# EAGLE design FilterSchematicsAttempt3 (EAGLE 8.2.2)
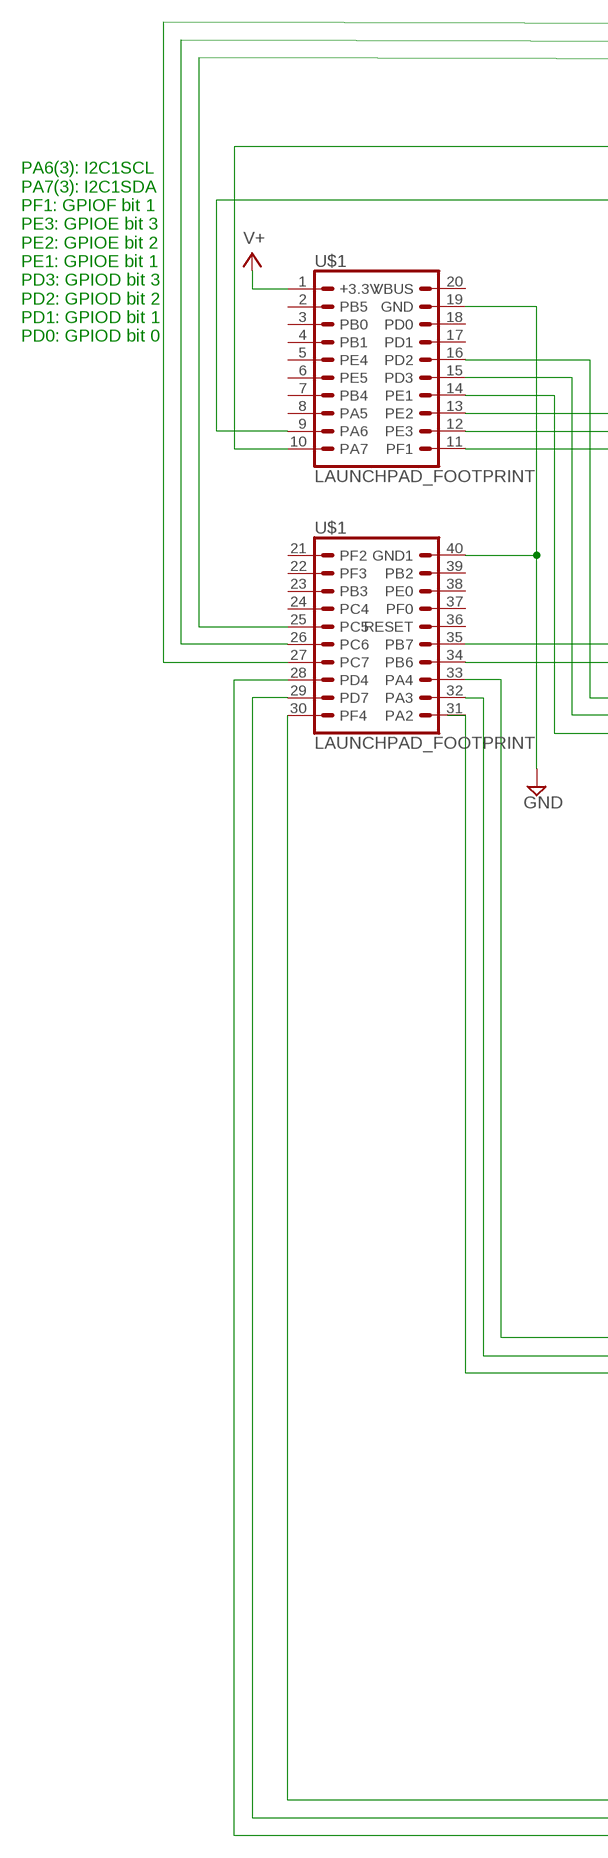
[diagram p0: schematic, sheet 1, part 1 of 3]
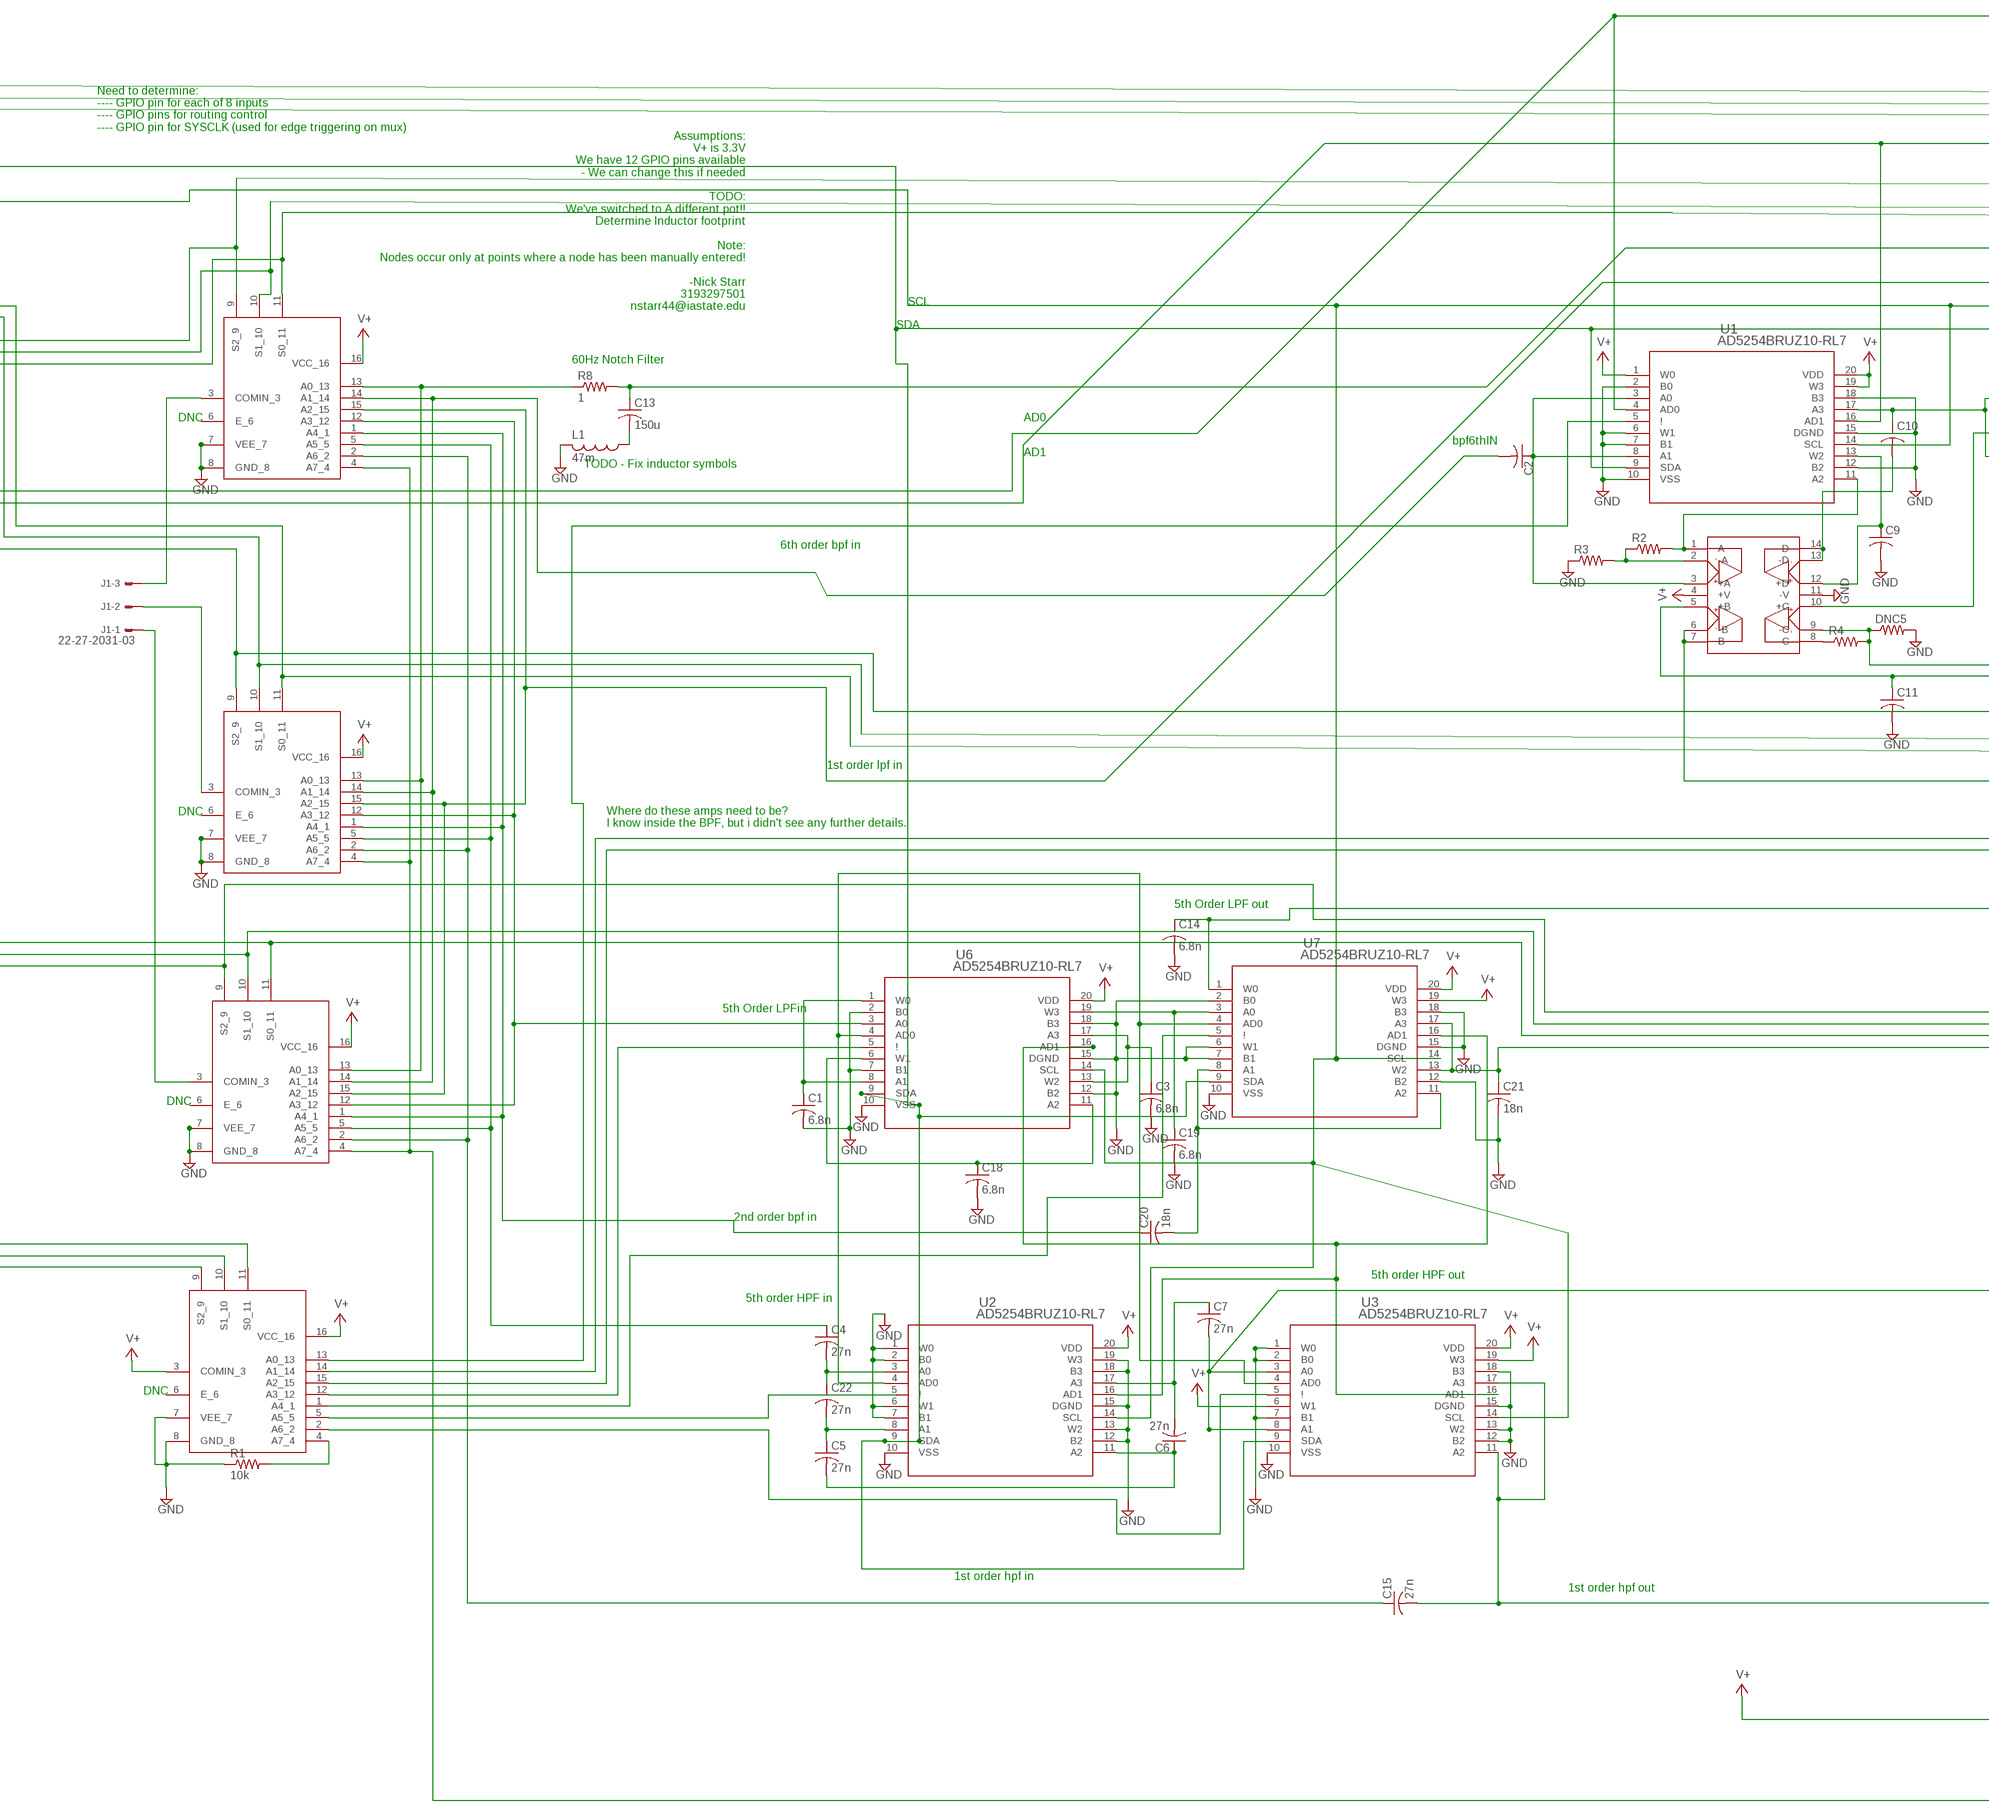
[diagram p1: schematic, sheet 1, part 2 of 3]
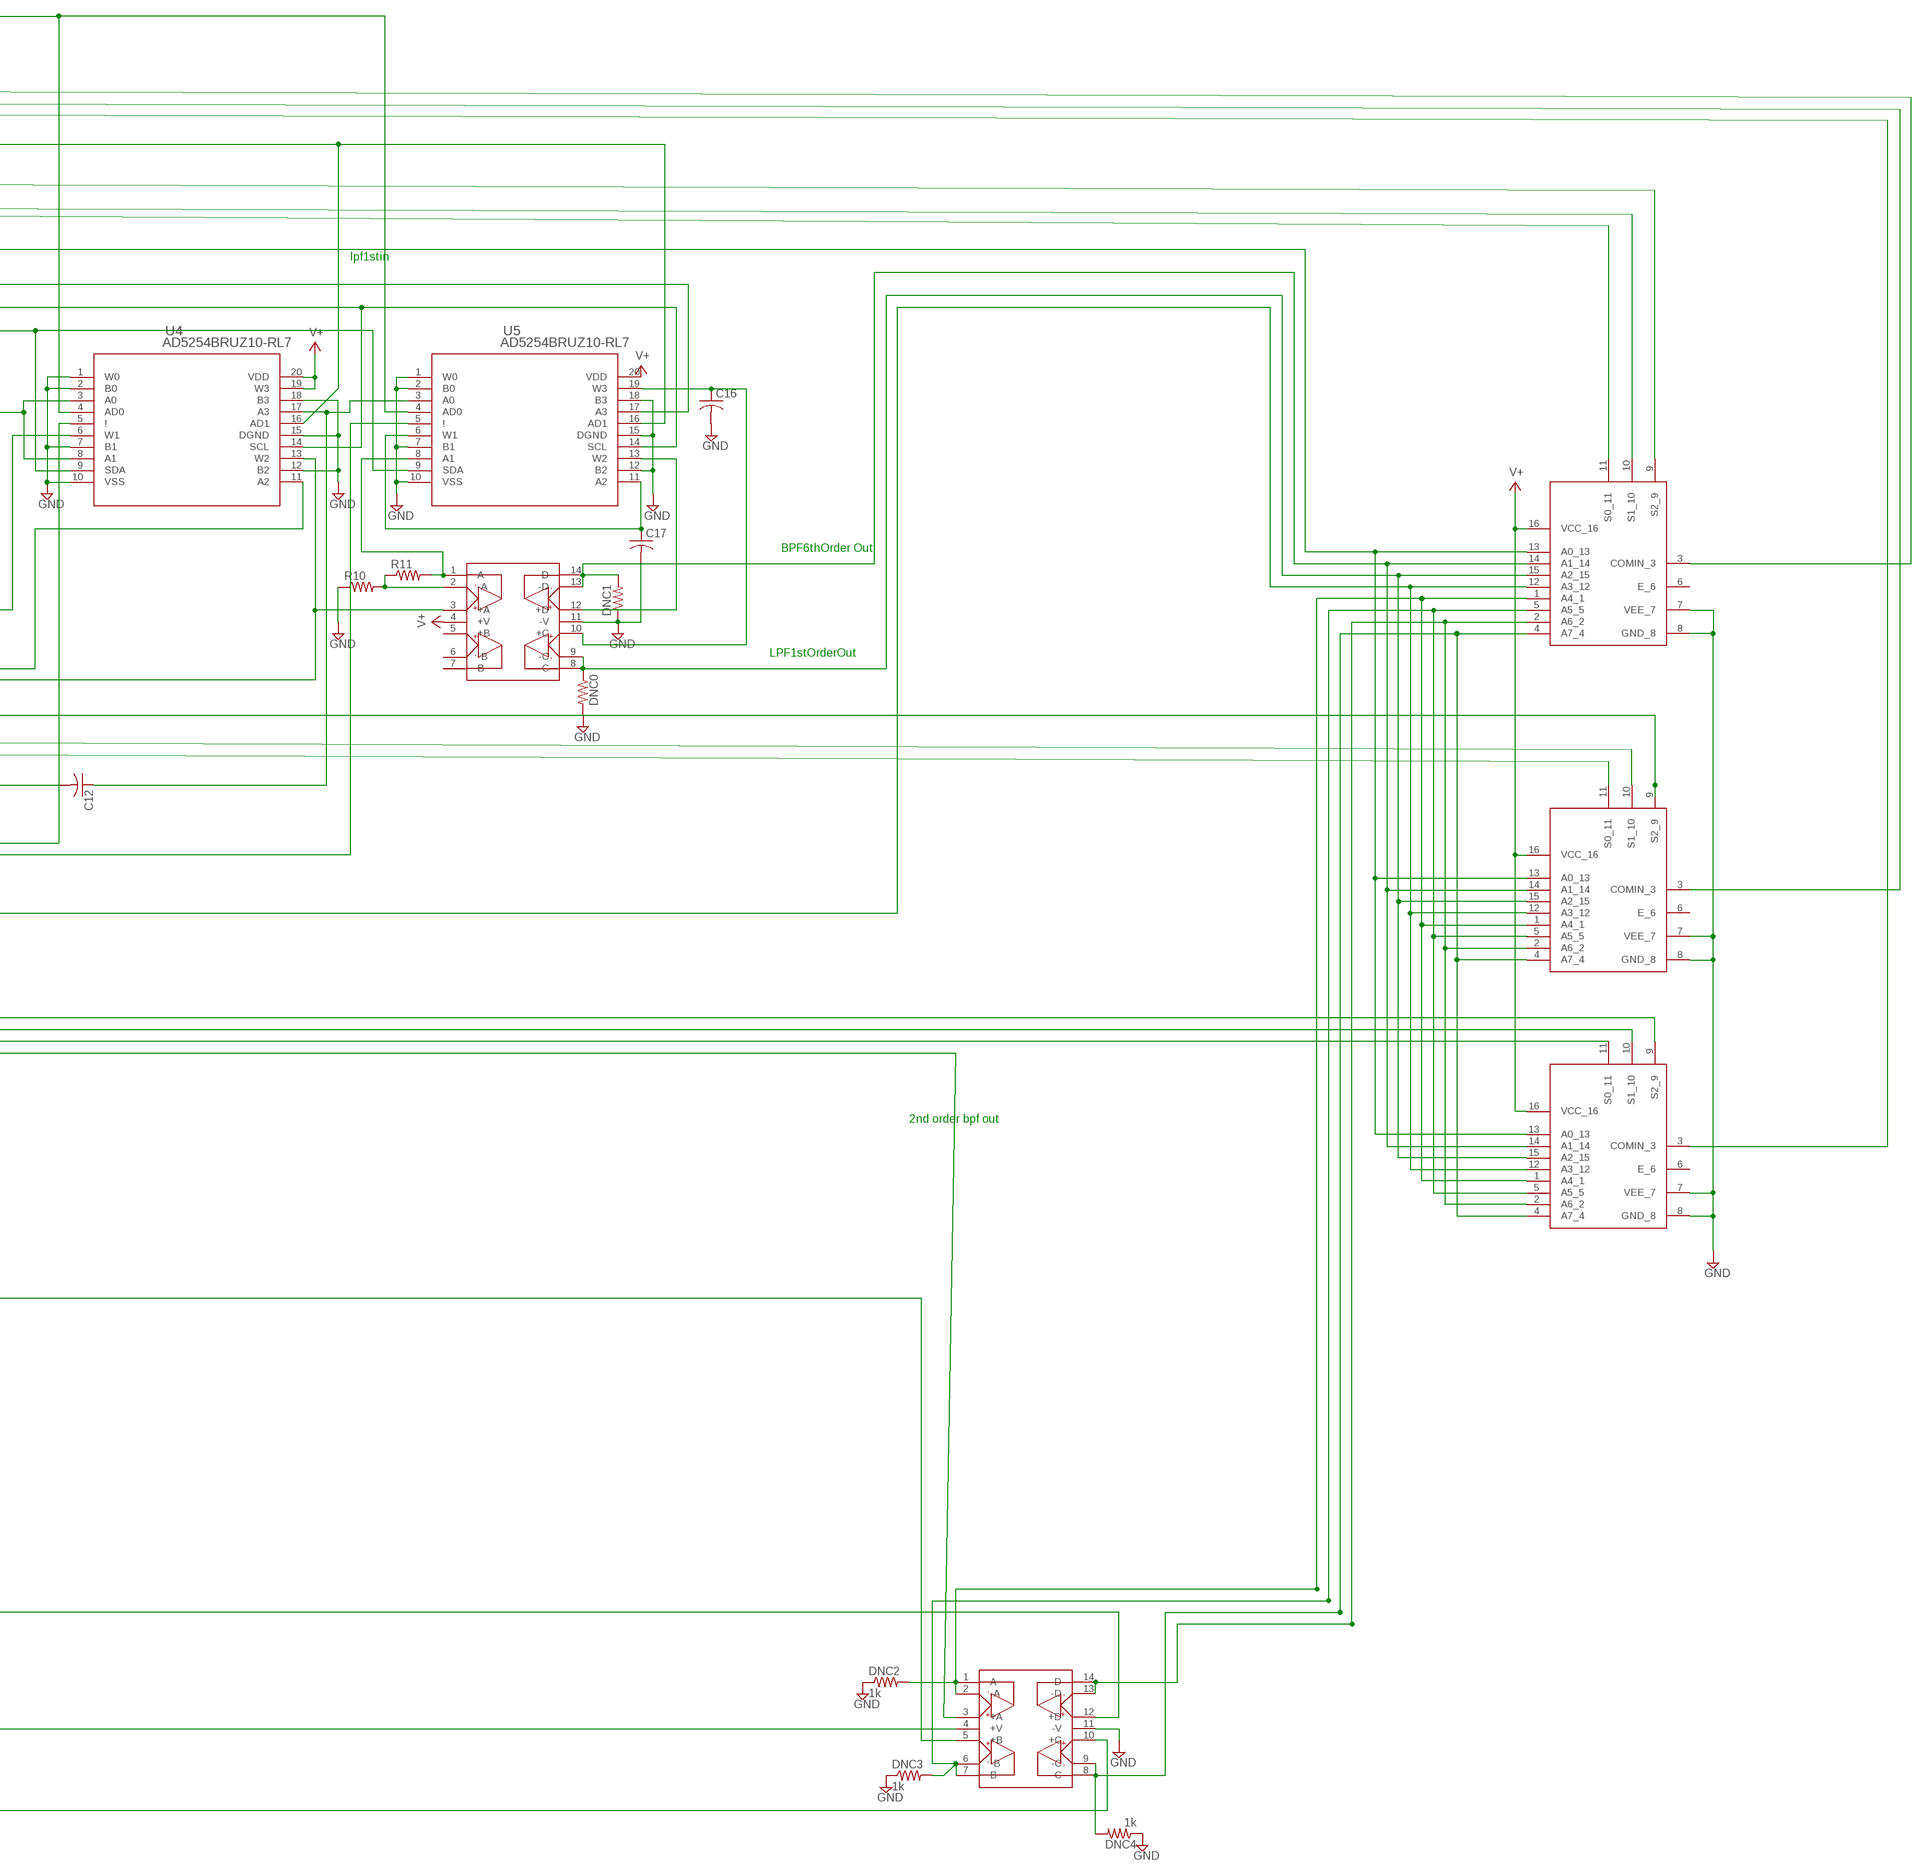
[diagram p2: schematic, sheet 1, part 3 of 3]

## Parts
C1  6.8n  C-USC0805  [C0805]
C2  C-USC0805  [C0805]
C3  6.8n  C-USC0805  [C0805]
C4  27n  C-USC0805  [C0805]
C5  27n  C-USC0805  [C0805]
C6  27n  C-USC0805  [C0805]
C7  27n  C-USC0805  [C0805]
C9  C-USC0805  [C0805]
C10  C-USC0805  [C0805]
C11  C-USC0805  [C0805]
C12  C-USC0805  [C0805]
C13  150u  C-USC0805  [C0805]
C14  6.8n  C-USC0805  [C0805]
C15  27n  C-USC0805  [C0805]
C16  C-USC0805  [C0805]
C17  C-USC0805  [C0805]
C18  6.8n  C-USC0805  [C0805]
C19  6.8n  C-USC0805  [C0805]
C20  18n  C-USC0805  [C0805]
C21  18n  C-USC0805  [C0805]
C22  27n  C-USC0805  [C0805]
DNC0  R-US_R0805  [R0805]
DNC1  R-US_R0805  [R0805]
DNC2  1k  R-US_R0805  [R0805]
DNC3  1k  R-US_R0805  [R0805]
DNC4  1k  R-US_R0805  [R0805]
DNC5  R-US_R0805  [R0805]
J1  22-27-2031-03  [6410-03]
L1  47m  L-US0204/5  [0204/5]
R1  10k  R-US_R0805  [R0805]
R2  R-US_R0805  [R0805]
R3  R-US_R0805  [R0805]
R4  R-US_R0805  [R0805]
R8  1  R-US_R0805  [R0805]
R10  R-US_R0805  [R0805]
R11  R-US_R0805  [R0805]
U1  AD5254BRUZ10-RL7  [RU_20]
U2  AD5254BRUZ10-RL7  [RU_20]
U3  AD5254BRUZ10-RL7  [RU_20]
U4  AD5254BRUZ10-RL7  [RU_20]
U5  AD5254BRUZ10-RL7  [RU_20]
U6  AD5254BRUZ10-RL7  [RU_20]
U7  AD5254BRUZ10-RL7  [RU_20]
U$1  LAUNCHPAD_FOOTPRINT  [SSW-110-02-S-D]
U$2  OPA4830  [TSSOP14]
U$3  CD74HC4051-Q1  [TSSOP16]
U$4  CD74HC4051-Q1  [TSSOP16]
U$5  CD74HC4051-Q1  [TSSOP16]
U$6  CD74HC4051-Q1  [TSSOP16]
U$7  OPA4830  [TSSOP14]
U$21  CD74HC4051-Q1  [TSSOP16]
U$22  CD74HC4051-Q1  [TSSOP16]
U$23  CD74HC4051-Q1  [TSSOP16]
U$25  OPA4830  [TSSOP14]

## Nets
GND: C1.2 C3.2 C9.2 C11.2 C14.2 C16.2 C17.2 C18.2 C19.2 C21.2 DNC0.2 DNC1.1 DNC2.1 DNC3.1 DNC4.1 DNC5.2 L1.2 R1.1 R3.1 R10.1 U1.2(B0) U1.6(W1) U1.7(B1) U1.10(VSS) U1.12(B2) U1.15(DGND) U1.18(B3) U2.1(W0) U2.2(B0) U2.6(W1) U2.7(B1) U2.10(VSS) U2.12(B2) U2.13(W2) U2.15(DGND) U2.18(B3) U2.19(W3) U3.1(W0) U3.2(B0) U3.7(B1) U3.10(VSS) U3.12(B2) U3.13(W2) U3.15(DGND) U3.18(B3) U4.1(W0) U4.2(B0) U4.7(B1) U4.10(VSS) U4.12(B2) U4.15(DGND) U4.18(B3) U5.1(W0) U5.2(B0) U5.7(B1) U5.10(VSS) U5.12(B2) U5.15(DGND) U5.18(B3) U6.2(B0) U6.7(B1) U6.10(VSS) U6.12(B2) U6.15(DGND) U6.18(B3) U7.2(B0) U7.6(W1) U7.7(B1) U7.10(VSS) U7.12(B2) U7.15(DGND) U7.18(B3) U$1.19(GND) U$1.40(GND1) U$2.11(-V) U$3.7(VEE_7) U$3.8(GND_8) U$4.7(VEE_7) U$4.8(GND_8) U$5.7(VEE_7) U$5.8(GND_8) U$6.7(VEE_7) U$6.8(GND_8) U$7.11(-V) U$21.7(VEE_7) U$21.8(GND_8) U$22.8(GND_8) U$23.7(VEE_7) U$23.8(GND_8)
N$1: J1.3 U$21.3(COMIN_3)
N$2: J1.2 U$22.3(COMIN_3)
N$3: J1.1 U$23.3(COMIN_3)
N$4: U$1.11(PF1) U$3.11(S0_11) U$21.11(S0_11)
N$5: C5.1 C22.2 U2.8(A1)
N$6: C4.2 C22.1 U2.3(A0)
N$7: C5.2 C6.1 U2.11(A2)
N$8: U$1.12(PE3) U$3.10(S1_10) U$21.10(S1_10)
N$9: U$1.13(PE2) U$3.9(S2_9) U$21.9(S2_9)
N$10: U$1.16(PD2) U$4.11(S0_11) U$22.11(S0_11)
N$11: U$1.15(PD3) U$4.10(S1_10) U$22.10(S1_10)
N$12: C2.1 U1.3(A0) U1.8(A1) U$2.3(+A)
N$13: C10.1 U1.17(A3) U4.3(A0) U4.8(A1)
N$14: C13.2 L1.1
N$15: U5.17(A3) U$21.15(A2_15) U$22.15(A2_15) U$23.15(A2_15)
N$16: C15.1 U$21.2(A6_2) U$22.2(A6_2) U$23.2(A6_2)
N$17: C15.2 U3.11(A2) U3.17(A3) U$25.12(+D)
N$18: U6.3(A0) U$21.12(A3_12) U$22.12(A3_12) U$23.12(A3_12)
N$19: U1.5(!) U$6.13(A0_13)
N$20: C1.1 U6.1(W0) U6.8(A1)
N$21: C3.1 U6.13(W2) U6.17(A3)
N$22: C18.1 U6.6(W1) U6.11(A2)
N$23: U$1.33(PA4) U$5.11(S0_11) U$23.11(S0_11)
N$24: R8.1 U$21.13(A0_13) U$22.13(A0_13) U$23.13(A0_13)
N$25: C2.2 U$21.14(A1_14) U$22.14(A1_14) U$23.14(A1_14)
N$26: U$1.32(PA3) U$5.10(S1_10) U$23.10(S1_10)
N$27: U$5.9(S2_9) U$23.9(S2_9)
N$28: R2.2 U1.11(A2) U$2.1(A)
N$29: C4.1 U$21.5(A5_5) U$22.5(A5_5) U$23.5(A5_5)
N$30: C21.1 U7.13(W2) U7.17(A3) U$25.3(+A)
N$31: U$21.4(A7_4) U$22.4(A7_4) U$23.4(A7_4) U$25.10(+C)
N$32: U1.9(SDA) U2.9(SDA) U3.9(SDA) U4.9(SDA) U5.9(SDA) U6.9(SDA) U7.9(SDA) U$1.10(PA7)
N$33: R1.2 U$6.4(A7_4)
N$34: U4.5(!) U$6.14(A1_14)
N$35: U5.5(!) U$6.15(A2_15)
N$36: U6.5(!) U$6.12(A3_12)
N$37: U7.5(!) U$6.1(A4_1)
N$38: U$6.5(A5_5)
N$41: C19.1 U6.19(W3) U7.3(A0)
N$42: DNC0.1 U$3.15(A2_15) U$4.15(A2_15) U$5.15(A2_15) U$7.8(C) U$7.9(-C)
N$44: U3.5(!) U$6.2(A6_2)
N$45: R2.1 R3.2 U$2.2(-A)
N$46: DNC3.2 U$3.5(A5_5) U$4.5(A5_5) U$5.5(A5_5) U$25.6(-B) U$25.7(B)
N$47: DNC2.2 U$3.1(A4_1) U$4.1(A4_1) U$5.1(A4_1) U$25.1(A) U$25.2(-A)
N$48: U$3.2(A6_2) U$4.2(A6_2) U$5.2(A6_2) U$25.13(-D) U$25.14(D)
N$49: DNC4.2 U$3.4(A7_4) U$4.4(A7_4) U$5.4(A7_4) U$25.8(C) U$25.9(-C)
N$50: C9.1 U1.13(W2) U$2.12(+D)
N$52: U1.16(AD1) U4.16(AD1) U5.16(AD1) U$1.34(PB6)
N$53: U4.6(W1) U$2.10(+C)
N$54: C10.2 U$2.13(-D) U$2.14(D)
N$55: U2.16(AD1) U3.16(AD1) U6.16(AD1) U7.16(AD1)
N$56: U$1.30(PF4) U$6.11(S0_11)
N$57: R4.1 U$2.8(C)
N$58: DNC5.1 R4.2 U4.11(A2) U$2.9(-C)
N$59: C20.1 U$21.1(A4_1) U$22.1(A4_1) U$23.1(A4_1)
N$60: C20.2 U7.8(A1) U7.11(A2)
N$61: U$22.7(VEE_7)
N$62: C6.2 C7.1 U2.17(A3)
N$63: C11.1 U4.13(W2) U$2.5(+B) U$7.3(+A)
N$64: U$1.25(PC5) U$5.3(COMIN_3)
N$65: U$1.26(PC6) U$4.3(COMIN_3)
N$66: U$1.28(PD4) U$6.9(S2_9)
N$67: C7.2 U3.3(A0) U3.8(A1) U$25.5(+B)
N$68: U$1.29(PD7) U$6.10(S1_10)
N$69: U$1.27(PC7) U$3.3(COMIN_3)
N$70: C12.1 U4.17(A3) U5.3(A0)
N$72: C12.2 U$2.6(-B) U$2.7(B)
N$73: R11.2 U5.8(A1) U$7.1(A)
N$74: R10.2 R11.1 U$7.2(-A)
N$75: C17.1 U5.6(W1) U5.11(A2)
N$76: U5.13(W2) U$7.12(+D)
N$77: DNC1.2 U$3.14(A1_14) U$4.14(A1_14) U$5.14(A1_14) U$7.13(-D) U$7.14(D)
N$79: C16.1 U5.19(W3) U$7.10(+C)
N$80: C14.1 U7.1(W0) U$3.12(A3_12) U$4.12(A3_12) U$5.12(A3_12)
N$88: C13.1 R8.2 U$3.13(A0_13) U$4.13(A0_13) U$5.13(A0_13)
N$95: U$1.14(PE1) U$4.9(S2_9) U$22.9(S2_9)
N$97: U2.4(AD0) U3.4(AD0) U6.4(AD0) U7.4(AD0)
N$98: U1.4(AD0) U4.4(AD0) U5.4(AD0) U$1.35(PB7)
N$101: U1.14(SCL) U2.14(SCL) U3.14(SCL) U4.14(SCL) U5.14(SCL) U6.14(SCL) U7.14(SCL) U$1.9(PA6)
V+: U1.1(W0) U1.19(W3) U1.20(VDD) U2.20(VDD) U3.6(W1) U3.19(W3) U3.20(VDD) U4.19(W3) U4.20(VDD) U5.20(VDD) U6.20(VDD) U7.19(W3) U7.20(VDD) U$1.1(+3.3V) U$2.4(+V) U$3.16(VCC_16) U$4.16(VCC_16) U$5.16(VCC_16) U$6.3(COMIN_3) U$6.16(VCC_16) U$7.4(+V) U$22.16(VCC_16) U$23.16(VCC_16) U$25.4(+V)
V-: U$25.11(-V) ; supply symbol labelled GND
Unconnected: U2.5(!) U$1.2(PB5) U$1.3(PB0) U$1.4(PB1) U$1.5(PE4) U$1.6(PE5) U$1.7(PB4) U$1.8(PA5) U$1.17(PD1) U$1.18(PD0) U$1.20(VBUS) U$1.21(PF2) U$1.22(PF3) U$1.23(PB3) U$1.24(PC4) U$1.31(PA2) U$1.36(RESET) U$1.37(PF0) U$1.38(PE0) U$1.39(PB2) U$3.6(E_6) U$4.6(E_6) U$5.6(E_6) U$6.6(E_6) U$7.5(+B) U$7.6(-B) U$7.7(B) U$21.6(E_6) U$21.16(VCC_16) U$22.6(E_6) U$23.6(E_6)

## Notes on the sheet
- Assumptions:
  V+ is 3.3V
  We have 12 GPIO pins available
  - We can change this if needed
  
  TODO:
  We've switched to A different pot!!
  Determine Inductor footprint
  
  Note:
  Nodes occur only at points where a node has been manually entered!
  
  -Nick Starr
  3193297501
  nstarr44@iastate.edu
- Need to determine:
  ---- GPIO pin for each of 8 inputs
  ---- GPIO pins for routing control
  ---- GPIO pin for SYSCLK (used for edge triggering on mux)
- lpf1stin
- PA6(3): I2C1SCL
  PA7(3): I2C1SDA
  PF1: GPIOF bit 1
  PE3: GPIOE bit 3
  PE2: GPIOE bit 2
  PE1: GPIOE bit 1
  PD3: GPIOD bit 3
  PD2: GPIOD bit 2
  PD1: GPIOD bit 1
  PD0: GPIOD bit 0
- SCL
- SDA
- 60Hz Notch Filter
- DNC | AD0
- bpf6thIN
- AD1
- TODO - Fix inductor symbols
- 6th order bpf in | BPF6thOrder Out
- LPF1stOrderOut
- 1st order lpf in
- DNC
- Where do these amps need to be?
  I know inside the BPF, but i didn't see any further details.
- 5th Order LPF out
- 5th Order LPFin
- DNC
- 2nd order bpf out
- 2nd order bpf in
- 5th order HPF out
- 5th order HPF in
- DNC
- 1st order hpf in
- 1st order hpf out

## Library data of the parts
C1-C7 C9-C22 = rcl:C-US: CAPACITOR, American symbol
DNC0 DNC1-DNC5 R1-R4 R8 R10 R11 = rcl:R-US_: RESISTOR, American symbol
J1 = con-molex:22-?-03: CONNECTOR wire to board 2.54 mm (.1 inch) pitch header; OC_FARNELL: unknown; OC_NEWARK: unknown
L1 = rcl:L-US: INDUCTOR, American symbol
U1-U7 = 491Library:AD5254BRUZ10-RL7; MANUFACTURER_PART_NUMBER: AD5254BRUZ10RL7; VENDOR: Analog Devices Inc
U$1 = 491Library:LAUNCHPAD_FOOTPRINT
U$2 U$7 U$25 = 491Library:OPA4830
U$3-U$6 U$21-U$23 = 491Library:CD74HC4051-Q1

## Board
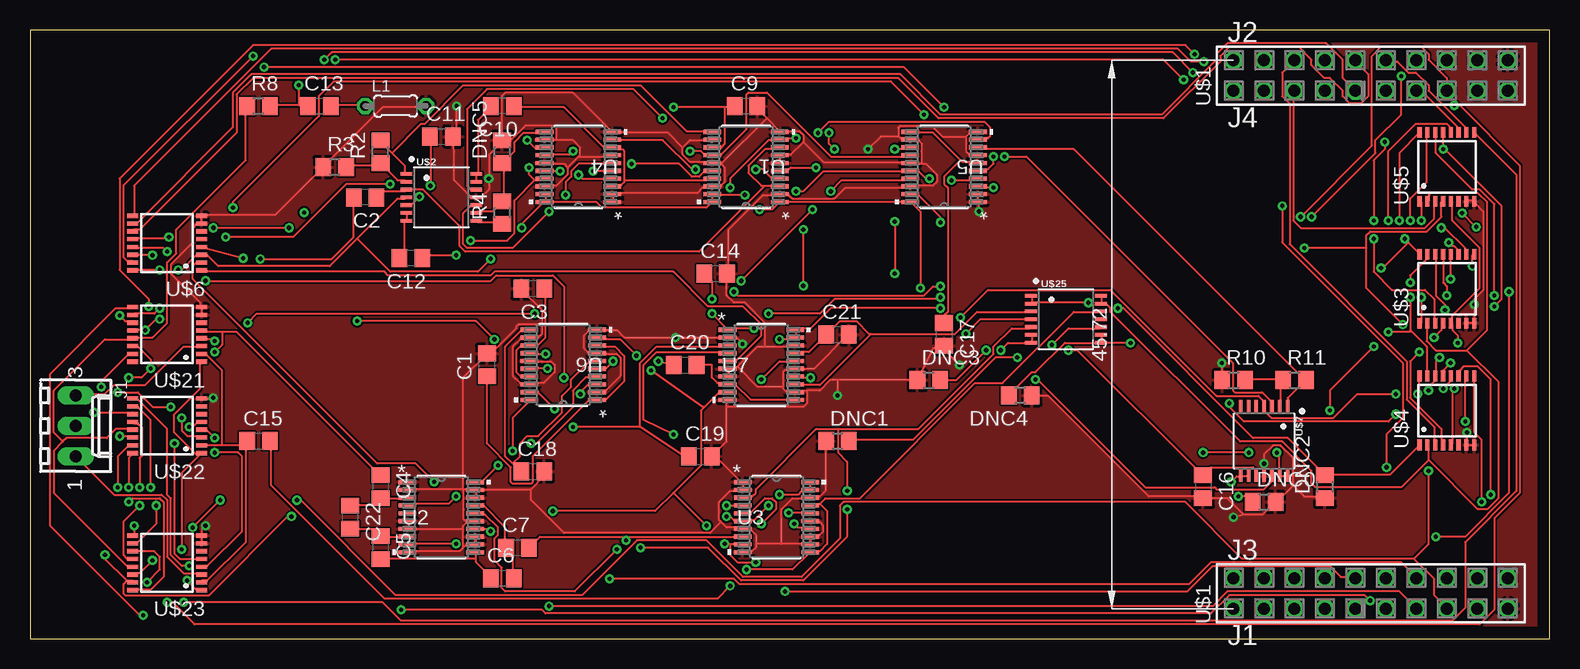
[diagram p3: board, top side]
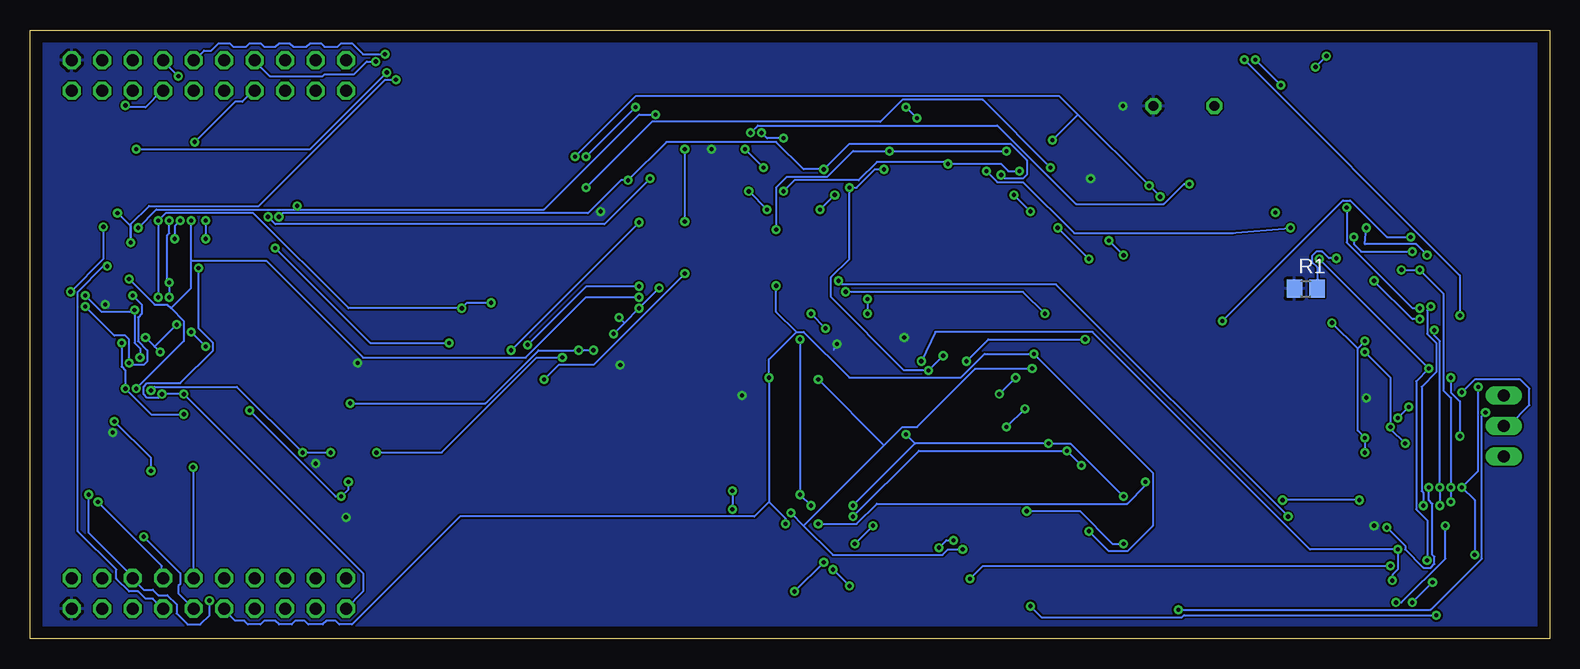
[diagram p4: board, bottom side, seen from below]

Size 126.67 x 50.79 mm. Coordinates in mm from the lower left corner, seen from the top.
Outline: 0,0 126.67,0 126.67,50.79 0,50.79 0,0
Copper layers (1*16): Top 0.035mm / dielectric 1.5mm / Bottom 0.035mm
Design rules "default": minimum track width 6mil, minimum drill 0.35mm, track to track 6mil, track to pad 6mil, pad to pad 6mil, via to via 6mil, smd to smd 6mil, copper to edge 40mil, drill to drill 6mil, minimum pad ring 10mil, minimum via ring 8mil, stop-mask expansion 4mil, vias tented up to drill 0mil, thermal gap 10mil

### Footprints (pad centres in the part's own frame; a part is rotated, then mirrored left to right if it is on the bottom)
C0805 = smd 1.3 x 1.5: 1 -0.95,0; 2 0.95,0
R0805 = smd 1.3 x 1.5: 1 -0.95,0; 2 0.95,0
6410-03 = drill 1.016 long: 1 2.54,0; 2 0,0; 3 -2.54,0
0204/5 = drill 0.813 octagon: 1 -2.54,0; 2 2.54,0
RU_20 = smd 1.473 x 0.356: 1 -2.819,2.925; 2 -2.819,2.275; 3 -2.819,1.625; 4 -2.819,0.975; 5 -2.819,0.325; 6 -2.819,-0.325; 7 -2.819,-0.975; 8 -2.819,-1.625; 9 -2.819,-2.275; 10 -2.819,-2.925; 11 2.819,-2.925; 12 2.819,-2.275; 13 2.819,-1.625; 14 2.819,-0.975; 15 2.819,-0.325; 16 2.819,0.325; 17 2.819,0.975; 18 2.819,1.625; 19 2.819,2.275; 20 2.819,2.925
SSW-110-02-S-D = drill 1 pad 1.5 octagon: 1 -22.86,11.43; 2 -20.32,11.43; 3 -22.86,8.89; 4 -20.32,8.89; 5 -22.86,6.35; 6 -20.32,6.35; 7 -22.86,3.81; 8 -20.32,3.81; 9 -22.86,1.27; 10 -20.32,1.27; 11 -22.86,-1.27; 12 -20.32,-1.27; 13 -22.86,-3.81; 14 -20.32,-3.81; 15 -22.86,-6.35; 16 -20.32,-6.35; 17 -22.86,-8.89; 18 -20.32,-8.89; 19 -22.86,-11.43; 20 -20.32,-11.43; 21 20.32,11.43; 22 22.86,11.43; 23 20.32,8.89; 24 22.86,8.89; 25 20.32,6.35; 26 22.86,6.35; 27 20.32,3.81; 28 22.86,3.81; 29 20.32,1.27; 30 22.86,1.27; 31 20.32,-1.27; 32 22.86,-1.27; 33 20.32,-3.81; 34 22.86,-3.81; 35 20.32,-6.35; 36 22.86,-6.35; 37 20.32,-8.89; 38 22.86,-8.89; 39 20.32,-11.43; 40 22.86,-11.43
TSSOP14 = smd 0.305 x 0.991: 1 -1.95,-2.918; 2 -1.3,-2.918; 3 -0.65,-2.918; 4 0,-2.918; 5 0.65,-2.918; 6 1.3,-2.918; 7 1.95,-2.918; 8 1.95,2.918; 9 1.3,2.918; 10 0.65,2.918; 11 0,2.918; 12 -0.65,2.918; 13 -1.3,2.918; 14 -1.95,2.918
TSSOP16 = smd 0.9 x 0.35: 1 -2.875,2.275; 2 -2.875,1.625; 3 -2.875,0.975; 4 -2.875,0.325; 5 -2.875,-0.325; 6 -2.875,-0.975; 7 -2.875,-1.625; 8 -2.875,-2.275; 9 2.875,-2.275; 10 2.875,-1.625; 11 2.875,-0.975; 12 2.875,-0.325; 13 2.875,0.325; 14 2.875,0.975; 15 2.875,1.625; 16 2.875,2.275

### Placement (x,y rotation side)
C1  38.1,22.86 90 top
C2  27.94,36.83 180 top
C3  41.91,29.21 180 top
C4  29.21,12.7 270 top
C5  29.21,7.62 270 top
C6  39.37,5.08 0 top
C7  40.64,7.62 0 top
C9  59.69,44.45 0 top
C10  39.37,44.45 180 top
C11  34.29,41.91 0 top
C12  31.75,31.75 180 top
C13  24.13,44.45 0 top
C14  57.15,30.48 0 top
C15  19.05,16.51 0 top
C16  97.79,12.7 270 top
C17  76.2,25.4 270 top
C18  41.91,13.97 0 top
C19  55.88,15.24 0 top
C20  54.61,22.86 0 top
C21  67.31,25.4 0 top
C22  26.67,10.16 270 top
DNC0  102.87,11.43 0 top
DNC1  67.31,16.51 0 top
DNC2  107.95,12.7 90 top
DNC3  74.93,21.59 0 top
DNC4  82.55,20.32 180 top
DNC5  39.37,40.64 90 top
J1  3.81,17.78 270 top
L1  30.48,44.45 0 top
R1  20.32,29.21 0 bottom
R2  29.21,40.64 90 top
R3  25.4,39.37 0 top
R4  39.37,35.56 90 top
R8  19.05,44.45 0 top
R10  100.33,21.59 0 top
R11  105.41,21.59 0 top
U1  59.69,39.37 180 top
U2  34.29,10.16 0 top
U3  62.23,10.16 0 top
U4  45.72,39.37 180 top
U5  76.2,39.37 180 top
U6  44.45,22.86 180 top
U7  60.96,22.86 0 top
U$1  111.76,25.4 90 top
U$2  34.29,36.83 270 top
U$3  118.11,29.21 90 top
U$4  118.11,19.05 90 top
U$5  118.11,39.37 90 top
U$6  11.43,33.02 180 top
U$7  102.87,16.51 180 top
U$21  11.43,25.4 180 top
U$22  11.43,17.78 180 top
U$23  11.43,6.35 180 top
U$25  86.36,26.67 270 top

### Tracks (layer width: path | path; a pad name or v marks a point on that pad's centre or on a via)
GND  (via drill 0.35)
  Top 0.152: DNC5.2 39.32,41.45 38.25,40.39 v38.25,38.41 38.25,37.49 37.64,36.88 37.34,36.88 U$2.11 37.19,36.88 36.73,36.88 35.36,38.25 35.36,40.64 C11.2 35.56,41.91 v35.56,44.45 | 44.81,39.32 44.81,38.71 43.89,37.8 42.98,37.8 U4.18 | 44.81,39.32 44.5,39.62 42.98,39.62 U4.15 | 45.87,40.23 45.72,40.23 44.81,39.32 | 45.87,40.23 48.46,40.23 U4.7 | 43.89,41.6 45.26,41.6 45.87,41 45.87,40.23 | 43.89,41.6 42.98,41.6 U4.12 | 43.89,41.6 43.89,42.67 43.74,42.82 41.3,42.82 40.08,41.6 39.47,41.6 DNC5.2 | 78.03,41.91 78.03,40.69 78.33,40.39 78.94,40.39 U5.7 | 78.03,41.91 78.33,42.22 78.94,42.22 U5.10 | 74.37,39.62 73.46,39.62 U5.15 73.3,39.78 66.14,39.78 64.47,41.45 | 74.37,39.62 74.68,39.62 75.59,38.71 75.59,38.1 75.29,37.8 73.46,37.8 U5.18 73.3,37.64 67.97,37.64 67.06,36.73 63.55,36.73 63.25,37.03 62.64,37.03 U1.2 62.48,37.03 61.11,37.03 58.22,34.14 58.22,30.48 C14.2 58.06,30.48 58.06,28.65 58.67,28.04 59.59,28.04 61.27,26.36 61.27,24.38 | 74.37,39.62 74.37,41.3 74.07,41.6 73.46,41.6 U5.12 73.3,41.76 72.54,41.76 72.39,41.91 | 78.03,41.91 76.05,41.91 75.13,42.82 72.54,42.82 72.39,42.67 72.39,41.91 | U1.6 62.48,39.78 62.48,40.23 U1.7 62.64,40.39 63.4,40.39 64.47,41.45 | 61.42,43.43 60.5,44.35 C9.2 | 61.42,43.43 62.48,42.37 U1.10 62.64,42.37 64.16,42.37 64.47,42.06 64.47,41.45 | U4.1 48.62,36.58 48.62,37.03 U4.2 48.62,37.19 55.63,37.19 56.08,37.64 56.84,37.64 U1.18 57,37.8 57.61,37.8 57.91,38.1 57.91,39.32 57.61,39.62 | 57.61,39.62 57,39.62 U1.15 56.84,39.78 55.02,39.78 54.41,40.39 54.41,41 | 54.41,41 55.02,41.6 56.84,41.6 U1.12 | 54.41,41 53.19,42.22 48.62,42.22 U4.10 48.46,42.37 45.26,45.57 39.62,45.57 39.32,45.26 39.32,41.6 DNC5.2
  Top 0.152: 57.61,39.62 61.42,43.43 | U6.15 41.76,23.16 43.43,23.16 43.74,22.86 43.74,22.25 42.82,21.34 41.76,21.34 U6.18 41.6,21.34 40.84,21.34 40.23,21.95 40.23,24.38 40.84,24.99 41.6,24.99 U6.12 41.76,25.15 42.37,25.15 42.67,25.45 42.67,26.21 | 42.67,26.21 42.67,27.43 41,29.11 C3.2 | 42.67,26.21 40.69,26.21 40.54,26.06 40.54,25.91 38.56,23.93 38.1,23.93 C1.2 38.1,23.77 36.12,21.79 36.12,12.5 | U2.6 31.55,9.75 31.55,9.3 U2.7 31.55,9.14 36.12,9.14 | 36.12,7.62 36.27,7.77 37.03,7.77 U2.12 37.19,7.92 37.19,8.53 U2.13 | 36.12,7.62 35.81,7.32 31.55,7.32 U2.10 | 36.42,9.75 37.03,9.75 U2.15 36.42,9.75 | 36.42,9.75 36.12,9.45 36.12,9.14 | 36.12,7.62 36.12,9.14 | 31.55,12.5 31.55,12.95 U2.1 | U2.18 37.19,11.89 37.19,12.34 U2.19 | 41.76,12.5 42.82,13.56 42.82,13.87 C18.2 | 41.76,12.5 37.19,12.5 U2.19 | 36.12,12.5 37.03,12.5 U2.19 | 36.12,12.5 31.55,12.5 | 31.55,12.5 U2.2 | 36.42,9.75 36.12,10.06 36.12,12.5 | 58.06,19.36 58.06,16.46 57,15.39 | 58.06,19.36 58.06,19.81 U7.10 | 57,15.39 56.84,15.24 C19.2 57,15.39 | 57,15.39 59.28,13.11 U3.1 59.44,12.95 59.44,12.5 U3.2 59.28,12.34 58.37,12.34 57.45,11.43 57.45,9.91 57.61,9.75 | DNC1.1 66.29,16.46 66.29,12.34 65.84,11.89 65.08,11.89 U3.18 64.92,11.73 63.55,11.73 62.64,10.82 62.64,7.92 | 60.5,7.92 60.5,8.69 60.05,9.14 59.44,9.14 U3.7 59.28,9.3 58.06,9.3 57.61,9.75 | 60.5,7.92 60.5,7.62 60.2,7.32 59.44,7.32 U3.10 | U3.15 65.08,9.75 65.84,9.75 66.14,9.45 66.14,8.99 65.84,8.69 65.08,8.69 U3.13 65.08,8.53 65.08,7.92 U3.12 64.92,7.92 62.64,7.92 | 62.64,7.92 60.5,7.92 | U7.7 58.22,21.95 58.22,22.4 U7.6 58.22,22.55 58.83,22.55 58.98,22.71 | 61.27,24.38 60.66,24.38 58.98,22.71
  Top 0.152: 61.27,24.38 63.7,24.38 U7.18 | 62.79,21.03 62.79,22.25 62.94,22.4 63.7,22.4 U7.15 63.86,22.55 65.38,22.55 68.12,25.3 C21.2 | 62.79,21.03 62.79,20.88 62.94,20.73 63.7,20.73 U7.12 63.86,20.73 64.77,20.73 | 64.77,20.73 65.84,20.73 66.7,21.59 DNC3.1 75.29,24.23 76.05,24.23 76.2,24.38 C17.2 76.2,24.13 v77.47,22.86 | 58.98,22.71 60.66,21.03 62.79,21.03 | 58.06,19.36 64.47,19.36 64.77,19.66 64.77,20.73 | 41.76,12.5 41.76,11.58 44.5,8.84 56.69,8.84 57.61,9.75 | U$7.11 v102.87,14.63 102.87,15.39 103.63,16.15 104.24,16.15 105.31,15.09 105.31,12.8 | 105.31,12.8 103.94,11.43 DNC0.2 103.78,11.43 102.72,10.36 101.19,10.36 | 101.19,10.36 99.82,11.73 97.84,11.73 C16.2 97.69,11.89 93.27,11.89 84.89,20.27 83.52,20.27 DNC4.1 | 105.31,12.8 106.22,11.89 107.9,11.89 DNC2.1 | U6.2 47.4,20.73 48.01,20.73 49.23,21.95 49.23,23.47 48.92,23.77 47.4,23.77 U6.7 47.24,23.93 46.48,23.93 46.18,24.23 46.18,25.3 46.63,25.76 47.24,25.76 U6.10 47.4,25.76 48.92,25.76 49.53,25.15 v53.8,25.15 58.06,25.15 U7.2 58.88,25.14 v59.41,24.6 | U$3.7 119.79,26.36 120.24,26.36 U$3.8 120.4,26.36 v120.4,27.89 120.4,28.35 121.16,29.11 121.16,35.66 120.4,36.42 U$5.8 120.24,36.58 119.79,36.58 U$5.7 | U$21.7 14.33,27.13 14.33,27.58 U$21.8 14.17,27.74 14.17,28.04 11.73,30.48 11.73,31.24 13.56,33.07 13.56,34.29 13.87,34.59 14.17,34.59 U$6.7 14.33,34.75 14.33,35.2 U$6.8 14.33,35.36 20.42,35.36 24.38,39.32 R3.1 24.54,39.47 29.41,44.35 32.92,44.35 L1.2 | U$4.8 120.24,16.15 119.79,16.15 U$4.7 119.79,16.31 v119.79,17.22 | U$23.7 14.33,8.08 14.33,8.53 U$23.8 14.33,8.69 14.33,9.14 v14.63,9.45
  Top 0.152: 15.39,20.12 v15.26,20.12 15.2,20.05 U$22.8 | v99.36,23.01 99.36,21.64 R10.1 | v79.1,35.66 79.1,36.42 U5.1 U5.2 | 67.31,21.59 v67.31,20.32 | 72.39,41.91 70.92,41.91 v69.85,40.84 | 101.19,10.36 v100.33,10.16
  Bottom 0.152: 59.69,24.13 59.41,24.41 v59.41,24.6 | v69.85,40.84 69.85,40.64
  pour Bottom: 0,50.8 0,0 127,0 127,50.8
  pour Top: 0,50.8 0,0 127,0 127,50.8
N$1
  Top 0.152: U$21.3 14.17,24.38 12.8,24.38 9.6,21.18 7.01,21.18 6.25,20.42 3.81,20.42 J1.3
N$2  (via drill 0.35)
  Top 0.152: v12.65,18.44 12.65,17.37 13.11,16.92 14.17,16.92 U$22.3 | v11.73,19.36 10.21,19.36 8.99,20.57 v7.32,20.57
  Bottom 0.152: v11.73,19.36 v12.65,18.44 | v7.32,20.57 6.25,21.64 2.44,21.64 1.68,20.88 1.68,19.51 3.35,17.83 3.81,17.83 J1.2
N$3
  Top 0.152: J1.1 7.01,12.04 10.97,12.04 11.43,11.58 11.43,6.86 12.8,5.49 14.17,5.49 U$23.3
N$4  (via drill 0.35)
  Top 0.152: v7.47,26.98 7.92,26.52 8.53,26.52 U$21.11 | v25.45,48.31 94.49,48.31 v96.16,46.63 | v118.26,33.07 118.57,32.77 118.72,32.77 119.02,32.46 119.02,32.16 U$3.11 | v117.2,8.53 119.63,8.53 123.29,12.19 v123.29,28.96 | v119.38,35.51 120.53,34.37 v120.55,34.37
  Bottom 0.152: v7.47,26.98 7.47,30.33 v25.45,48.31 | v96.16,46.63 97.08,46.63 107.59,36.12 116.74,36.12 118.26,34.59 v118.26,33.07 118.26,34.44 119.38,35.56 v119.38,35.51 | U$1.11 114.3,3.81 114.3,4.42 114.15,4.57 114.15,5.49 v117.2,8.53 | v123.29,28.96 120.57,31.67 120.57,34.29 | 120.57,34.29 120.57,34.37 | v120.55,34.37 120.57,34.34 120.57,34.29
N$5
  Top 0.152: U2.8 31.39,8.53 29.26,8.53 C5.1 29.11,8.69 28.65,9.14 26.67,9.14 C22.2
N$6
  Top 0.152: U2.3 31.39,11.73 29.26,11.73 C4.2 29.11,11.73 28.5,11.12 26.67,11.12 C22.1
N$7
  Top 0.152: 37.19,6.71 37.19,6.4 38.41,5.18 C6.1 | 37.19,6.71 37.19,7.16 U2.11 | 37.19,6.71 29.26,6.71 C5.2
N$8  (via drill 0.35)
  Top 0.152: v10.82,27.58 10.36,27.13 8.69,27.13 U$21.10 | v16.92,35.97 16.92,36.42 24.08,43.59 24.08,45.26 25.3,46.48 71.78,46.48 v74.52,43.74 | v117.65,34.29 117.96,34.29 119.63,32.61 119.63,32.16 U$3.10 | v113.08,14.33 113.08,17.07 114.45,18.44 114.45,23.01 104.39,33.07 v104.39,36.12
  Bottom 0.152: v10.82,27.58 11.43,27.58 16.92,33.07 v16.92,35.97 | v74.52,43.74 75.89,43.74 83.82,35.81 104.39,35.81 | 104.39,35.81 116.13,35.81 v117.65,34.29 | v113.08,14.33 113.08,5.18 U$1.12 | 104.39,35.81 v104.39,36.12
N$9  (via drill 0.35)
  Top 0.152: v9.45,1.98 9.14,1.98 1.68,9.45 1.68,22.1 7.16,27.58 8.53,27.58 U$21.9 | v43.28,2.74 98.6,2.74 99.82,3.96 114.15,3.96 U$1.13 | v120.24,31.09 120.24,32 U$3.9
  Bottom 0.152: v9.45,1.98 30.48,1.98 30.63,1.83 42.37,1.83 v43.28,2.74 | v120.24,31.09 120.55,31.09 122.68,28.96 122.68,8.99 119.48,5.79 119.48,5.03 118.42,3.96 117.65,3.96 117.04,3.35 116.43,3.35 115.67,2.59 U$1.13
N$10  (via drill 0.35)
  Top 0.152: v5.33,18.9 8.53,18.9 U$22.11 | v30.94,2.44 42.67,2.44 42.98,2.13 98.45,2.13 99.97,3.66 111.25,3.66 v111.71,3.2 | v121.77,12.04 121.77,21.64 120.7,22.71 119.48,22.71 119.18,22.4 119.18,21.95 U$4.11
  Bottom 0.152: v5.33,18.9 5.64,18.59 5.64,6.71 9.91,2.44 v30.94,2.44 | v111.71,3.2 111.71,1.98 112.47,1.22 113.54,1.22 114.45,2.13 114.45,2.9 115.21,3.66 115.98,3.66 116.43,4.12 117.2,4.12 118.11,5.03 U$1.16 118.11,5.18 121.77,8.84 v121.77,12.04
N$11  (via drill 0.35)
  Top 0.152: v10.06,12.65 10.06,18.29 8.99,19.36 8.69,19.36 U$22.10 | v22.25,11.58 22.55,11.58 30.48,3.66 46.02,3.66 50.6,8.23 56.39,8.23 59.44,5.18 64.31,5.18 67.51,8.38 67.51,11.12 67.82,11.43 96.32,11.43 101.04,6.71 115.37,6.71 | 115.37,6.71 117.04,5.03 117.04,3.66 118.11,2.59 U$1.15 | v119.63,18.14 119.63,21.79 U$4.10 | v116.59,14.02 116.59,7.92 115.37,6.71 | v15.85,11.58 v13.56,9.3
  Bottom 0.152: v10.06,12.65 10.06,11.58 9.75,11.28 9.75,7.01 9.6,6.86 9.6,6.25 9.91,5.94 10.52,5.94 12.04,7.47 12.04,7.77 v13.56,9.3 | v15.85,11.58 v22.25,11.58 | v119.63,18.14 116.59,15.09 v116.59,14.02
N$12
  Top 0.152: C2.1 28.96,36.88 29.41,37.34 31.24,37.34 U$2.3 31.39,37.49 32.77,37.49 35.81,34.44 35.81,32.77 36.27,32.31 55.78,32.31 61.27,37.8 | 61.27,37.8 60.96,37.8 59.89,38.86 59.89,39.47 61.27,40.84 62.48,40.84 U1.8 | 61.27,37.8 62.48,37.8 U1.3
N$13
  Top 0.152: 49.53,38.25 49.53,40.69 49.38,40.84 48.62,40.84 U4.8 48.46,41 47.85,41 44.5,44.35 40.39,44.35 C10.1 | 49.53,38.25 49.53,38.1 49.23,37.8 48.62,37.8 U4.3 | 49.53,38.25 56.84,38.25 U1.17
N$14
  Top 0.152: C13.2 25.15,44.5 27.89,44.5 L1.1
N$15  (via drill 0.35)
  Top 0.152: 8.08,4.88 8.53,4.88 U$23.15 | 8.08,4.88 6.25,6.71 v6.25,7.01 | v7.32,12.65 7.32,15.24 8.23,16.15 8.53,16.15 U$22.15 | v5.94,21.03 5.94,21.49 8.23,23.77 8.53,23.77 U$21.15 | v66.75,37.34 67.67,38.25 73.3,38.25 U5.17 | v59.28,29.87 v65.23,35.81 | v21.79,10.21 21.49,10.21 14.94,3.66 7.92,3.66 7.77,3.81 7.77,4.57 8.08,4.88
  Bottom 0.152: v6.25,7.01 6.25,11.58 v7.32,12.65 5.94,14.02 v5.94,21.03 | v65.23,35.81 v66.75,37.34 | v59.28,29.87 58.98,29.57 41.15,29.57 v21.79,10.21
N$16
  Top 0.152: 17.98,16.15 17.98,16.46 C15.1 17.98,16.15 | 17.98,16.15 17.98,8.08 14.78,4.88 14.33,4.88 U$23.2 | 17.98,16.15 16,16.15 | 16,16.15 14.33,16.15 U$22.2 | 16,16.15 16,22.4 14.63,23.77 14.33,23.77 U$21.2
N$17  (via drill 0.35)
  Top 0.152: 65.84,11.28 66.29,11.73 69.19,11.73 78.79,21.34 81.08,21.34 87.02,27.28 89.15,27.28 U$25.12 | 65.84,11.28 65.08,11.28 U3.17 | 65.84,11.28 66.45,10.67 66.45,7.92 65.84,7.32 65.08,7.32 U3.11 64.92,7.16 63.55,5.79 v59.74,5.79 | v58.37,4.42 57.3,3.35 29.57,3.35 20.12,12.8 20.12,16.46 C15.2
  Bottom 0.152: v59.74,5.79 v58.37,4.42
N$18  (via drill 0.35)
  Top 0.152: v9.14,11.12 7.77,9.75 7.77,7.01 8.08,6.71 8.53,6.71 U$23.12 | v9.14,12.65 9.14,15.09 9.3,15.24 9.3,17.68 8.99,17.98 8.69,17.98 U$22.12 | U$21.12 8.69,25.76 v9.6,25.76 10.52,26.67 v10.82,26.67 | v45.87,20.42 45.87,20.57 46.48,21.18 47.24,21.18 U6.3 | v44.5,21.79 44.5,29.41 43.59,30.33 38.86,30.33 38.41,29.87 v14.63,29.87
  Bottom 0.152: v9.14,11.12 v9.14,12.65 9.14,24.84 9.6,25.3 v9.6,25.76 | v44.5,21.79 v45.87,20.42 | v14.63,29.87 11.43,26.67 v10.82,26.67
N$19  (via drill 0.35)
  Top 0.152: v11.43,32.31 11.12,32.61 8.69,32.61 U$6.13 | v16.31,33.53 21.95,33.53 26.36,37.95 v30.02,37.95 | v66.6,42.22 66.6,41.3 v67.06,40.84 | v65.53,39.32 63.4,39.32 63.25,39.17 62.64,39.17 U1.5
  Bottom 0.152: v11.43,32.31 15.7,32.31 16.31,32.92 v16.31,33.53 | v30.02,37.95 30.48,37.95 32.16,36.27 39.47,36.27 46.02,42.82 65.99,42.82 v66.6,42.22 | v65.53,39.32 v67.06,40.84
N$20
  Top 0.152: U6.8 47.4,24.38 48.77,24.38 49.53,23.62 49.53,21.49 48.01,19.96 47.4,19.96 U6.1 47.24,19.81 46.48,19.81 41.91,15.24 41.91,13.11 41.76,12.95 40.23,12.95 40.08,13.11 40.08,14.33 38.1,16.31 C1.1
N$21
  Top 0.152: U6.17 41.6,21.95 40.84,21.95 40.54,22.25 40.54,24.08 40.84,24.38 41.6,24.38 U6.13 41.76,24.54 42.37,24.54 42.98,25.15 42.98,29.11 C3.1
N$22
  Top 0.152: 40.23,14.63 40.84,14.02 C18.1 | 40.23,14.63 39.62,15.24 39.62,24.38 41,25.76 41.6,25.76 U6.11 | 40.23,14.63 40.84,15.24 40.84,16.31 41.45,16.92 42.37,16.92 44.35,18.9 44.35,20.27 45.11,21.03 45.11,21.64 46.63,23.16 47.24,23.16 U6.6
N$23  (via drill 0.35)
  Top 0.152: v9.75,4.72 10.82,5.79 10.82,6.86 10.36,7.32 8.69,7.32 U$23.11 | v11.43,3.05 11.89,3.05 13.72,1.22 120.85,1.22 122.07,2.44 122.07,10.06 124.21,12.19 124.21,39.47 119.18,44.5 v118.72,44.5 | U$1.33 115.98,45.72 119.02,42.67 119.02,42.37 U$5.11
  Bottom 0.152: v11.43,3.05 v9.75,4.72 | v118.72,44.5 118.57,44.35 117.04,44.35 115.67,45.72 U$1.33
N$24
  Top 0.152: 2.74,16.46 3.05,16.76 6.4,16.76 7.16,17.53 8.53,17.53 U$22.13 | 2.74,16.46 1.98,15.7 1.98,12.19 8.08,6.1 8.53,6.1 U$23.13 | 2.74,16.46 1.98,17.22 1.98,20.73 6.25,24.99 8.53,24.99 U$21.13 8.69,25.15 10.21,25.15 11.43,26.36 11.43,31.39 12.19,32.16 12.19,34.14 17.98,39.93 17.98,44.35 R8.1
N$25  (via drill 0.35)
  Top 0.152: v10.21,6.55 9.14,5.49 8.69,5.49 U$23.14 | U$21.14 8.69,24.38 8.99,24.38 10.06,23.32 v10.06,22.55 9.3,21.79 v8.23,21.79 | v7.47,16.92 8.53,16.92 U$22.14 | v19.2,31.7 25.15,31.7 26.98,33.53 26.98,36.73 C2.2
  Bottom 0.152: v10.21,6.55 10.21,9.91 11.12,10.82 11.12,21.49 v10.06,22.55 v19.2,31.7 | v7.47,16.92 7.47,19.81 8.23,20.57 v8.23,21.79
N$26  (via drill 0.35)
  Top 0.152: v10.52,11.12 10.52,9.6 8.99,8.08 8.69,8.08 U$23.10 | v9.91,27.74 9.91,28.35 7.47,30.79 7.47,38.41 18.59,49.53 96.32,49.53 v97.08,48.77 | U$5.10 119.63,42.37 119.63,42.67 116.59,45.72 116.59,46.18 115.52,47.24 114.91,47.24 114,48.16 113.08,48.16 U$1.32
  Bottom 0.152: v10.52,11.12 10.52,12.19 10.67,12.34 10.67,21.03 9.45,22.25 9.45,24.69 10.21,25.45 10.21,27.43 v9.91,27.74 | v97.08,48.77 98.91,48.77 99.82,49.68 100.74,49.68 101.04,49.38 102.11,49.38 102.41,49.68 103.33,49.68 103.63,49.38 104.7,49.38 105,49.68 105.92,49.68 106.22,49.38 107.14,49.38 107.44,49.68 108.36,49.68 108.66,49.38 109.73,49.38 110.03,49.68 110.95,49.68 111.56,49.07 112.17,49.07 112.93,48.31 U$1.32
N$27  (via drill 0.35)
  Top 0.152: v8.69,9.45 8.69,8.69 U$23.9 | v12.8,3.05 29.41,3.05 30.94,1.52 118.57,1.52 119.63,2.59 119.63,8.08 123.9,12.34 123.9,38.71 120.4,42.22 U$5.9
  Bottom 0.152: v8.69,9.45 8.69,6.71 12.34,3.05 v12.8,3.05
N$28
  Top 0.152: 30.18,40.54 29.26,41.45 R2.2 | 30.18,40.54 31.24,39.47 31.24,38.86 U$2.1 | 30.18,40.54 32.61,42.98 32.92,42.98 36.12,46.18 50.9,46.18 54.71,42.37 56.84,42.37 U1.11
N$29  (via drill 0.35)
  Top 0.152: v12.04,16.31 12.04,7.16 12.5,6.71 14.17,6.71 U$23.5 | v13.26,17.68 13.56,17.68 13.87,17.98 14.17,17.98 U$22.5 | 16,25.6 17.22,25.6 29.11,13.72 C4.1 | 16,25.6 14.33,25.6 U$21.5 | v15.39,23.93 16,24.54 16,25.6
  Bottom 0.152: v12.04,16.31 13.26,17.53 v13.26,17.68 13.26,21.79 v15.39,23.93
N$30
  Top 0.152: 70.1,25.45 69.95,25.45 68.89,26.52 67.51,26.52 66.45,25.45 C21.1 66.29,25.3 64.92,23.93 63.86,23.93 U7.17 | 70.1,25.45 77.11,25.45 78.94,27.28 83.36,27.28 U$25.3 | 70.1,25.45 65.84,21.18 63.86,21.18 U7.13
N$31  (via drill 0.35)
  Top 0.152: v15.39,16.76 14.78,17.37 14.33,17.37 U$22.4 | U$23.4 14.33,6.1 14.78,6.1 17.68,8.99 17.68,15.24 17.39,15.53 17.36,15.53 17.34,15.54 v15.39,15.54 | v15.39,24.84 15.24,24.99 14.33,24.99 U$21.4 | v85.19,24.54 86.56,25.91 89.15,25.91 U$25.10 | v75.89,29.41 75.29,29.41 74.52,28.65 58.98,28.65 v58.67,28.96 | v42.06,27.13 18.9,27.13 v18.14,26.36
  Bottom 0.152: v15.39,15.54 v15.39,16.76 16,17.37 16,24.23 | 16,24.23 v15.39,24.84 | v85.19,24.54 80.31,29.41 v75.89,29.41 | v58.67,28.96 43.89,28.96 v42.06,27.13 | 16,24.23 v18.14,26.36
N$32  (via drill 0.35)
  Top 0.152: v55.47,39.17 55.17,39.17 52.73,41.6 48.62,41.6 U4.9 | v58.37,37.64 58.37,38.41 61.57,41.6 62.48,41.6 U1.9 62.64,41.76 v63.86,41.76 | v65.68,42.22 66.6,43.13 79.55,43.13 80.01,42.67 80.01,41.91 79.86,41.76 79.1,41.76 U5.9 | v35.51,7.92 31.55,7.92 U2.9 | v43.59,10.67 52.12,10.67 53.65,12.19 | 53.65,12.19 55.93,14.48 55.93,19.05 56.24,19.36 | 56.24,19.36 57.45,20.57 58.06,20.57 U7.9 | v50.55,23.62 50.6,23.62 49.23,24.99 47.4,24.99 U6.9 | v51.77,22.4 56.08,19.36 56.24,19.36 | v57.91,7.92 58.37,7.92 | 58.37,7.92 59.28,7.92 U3.9 | 53.65,12.19 v56.39,9.45 | v62.94,3.96 96.47,3.96 98.6,6.1 108.36,6.1 109.27,5.18 110.49,5.18 U$1.10 | v60.5,6.4 58.98,6.4 58.37,7.01 58.37,7.92
  Bottom 0.152: v55.47,39.17 56.24,39.17 57.76,37.64 v58.37,37.64 58.37,31.7 59.89,30.18 59.89,28.5 53.8,22.4 v51.77,22.4 v50.55,23.62 | v65.68,42.22 65.23,41.76 v63.86,41.76 | v35.51,7.92 36.42,7.92 39.17,10.67 v43.59,10.67 | v56.39,9.45 v57.91,7.92 | v60.5,6.4 v62.94,3.96
N$33  (via drill 0.35)
  Top 0.152: U$6.4 v17.78,31.75
  Bottom 0.152: R1.2 19.37,31.01 19.81,31.45 19.81,31.95 19.45,32.31 18.95,32.31 18.39,31.75 v17.78,31.75
N$34  (via drill 0.35)
  Top 0.152: v10.21,32 8.69,32 U$6.14 | v46.94,39.01 48.46,39.01 U4.5 | v21.59,34.29 v15.29,34.29 | v15.29,34.29 15.24,34.29 v15.29,34.29
  Bottom 0.152: v10.21,32 11.12,32.92 15.39,32.92 v15.29,34.29 | 26.67,33.83 39.62,33.83 43.89,38.1 46.02,38.1 v46.94,39.01 | 26.67,33.83 26.36,33.83 | 26.67,33.83 v21.59,34.29
N$35  (via drill 0.35)
  Top 0.152: v18.59,48.62 7.77,37.8 7.77,31.85 8.08,31.55 8.53,31.55 U$6.15 | v19.51,47.7 72.85,47.7 v76.2,44.35 | v80.31,40.23 80.31,39.62 79.86,39.17 79.1,39.17 U5.5
  Bottom 0.152: v19.51,47.7 v18.59,48.62 | v80.31,40.23 v76.2,44.35
N$36  (via drill 0.35)
  Top 0.152: v11.58,33.53 11.43,33.38 8.69,33.38 U$6.12 | v27.28,26.52 37.19,26.52 v38.71,24.99 | v48.62,23.16 48.01,22.55 47.4,22.55 U6.5
  Bottom 0.152: v11.58,33.53 13.56,33.53 16.61,36.58 17.22,36.58 v27.28,26.52 | v38.71,24.99 46.79,24.99 v48.62,23.16
N$37
  Top 0.152: U$6.1 14.33,30.63 29.57,30.63 29.87,30.33 38.41,30.33 38.71,30.63 53.65,30.63 56.54,27.74 59.44,27.74 60.96,26.21 60.96,25.3 58.98,23.32 58.22,23.32 U7.5
N$39  (via drill 0.35)
  other vias: 22.86,35.56
N$41  (via drill 0.35)
  Top 0.152: v43.74,19.2 42.37,20.57 41.76,20.57 U6.19 | 50.85,17.68 v45.26,17.68 | 50.85,17.68 54.56,15.24 C19.1 | 50.85,17.68 50.85,23.01 52.22,24.38 58.06,24.38 U7.3
  Bottom 0.152: v45.26,17.68 v43.74,19.2
N$42  (via drill 0.35)
  Top 0.152: U$7.9 101.5,13.56 101.04,13.56 U$7.8 100.89,13.56 100.58,13.56 v100.13,13.11 | v100.74,11.89 101.35,11.89 101.8,11.43 DNC0.1 | 115.21,25.6 115.06,25.76 v115.06,28.5 | 115.21,25.6 116.43,24.38 116.43,21.95 U$4.15 | v115.06,29.72 115.06,30.33 116.43,31.7 116.43,32 U$3.15 | v115.06,34.9 115.06,36.73 116.43,38.1 116.43,42.22 U$5.15 | v108.36,19.05 108.36,20.73 v112.01,24.38 | 115.21,25.6 v113.23,25.6
  Bottom 0.152: v100.13,13.11 100.13,12.5 v100.74,11.89 101.19,11.89 v108.36,19.05 | v115.06,28.5 v115.06,29.72 115.21,29.87 115.21,33.68 115.06,33.83 v115.06,34.9 | v113.23,25.6 v112.01,24.38
N$44  (via drill 0.35)
  Top 0.152: v33.68,13.11 32.16,14.63 28.96,14.63 13.56,30.02 13.56,31.09 13.87,31.39 14.17,31.39 U$6.2 | v60.96,9.6 62.18,10.82 62.18,11.43 61.87,11.73 61.27,11.73 60.05,10.52 59.44,10.52 U3.5
  Bottom 0.152: v33.68,13.11 33.68,12.8 35.2,11.28 56.08,11.28 57.76,9.6 v60.96,9.6
N$45
  Top 0.152: U$2.2 31.24,38.25 30.63,38.25 29.26,39.62 R2.1 29.11,39.62 28.96,39.47 26.36,39.47 R3.2
N$46  (via drill 0.35)
  Top 0.152: U$25.6 83.52,25.3 83.52,24.84 U$25.7 83.36,24.69 81.53,24.69 v80.92,24.08 | v118.72,20.88 118.57,20.73 118.57,16.31 U$4.5 | v119.02,24.69 119.02,25.3 118.57,25.76 118.57,26.21 U$3.5 118.57,26.36 118.57,26.98 120.85,29.26 120.85,32.61 118.57,34.9 118.57,36.42 U$5.5 | v99.97,19.66 99.97,19.36 101.19,18.14 113.23,18.14 v113.84,18.75 | DNC3.2 77.22,21.59 v79.7,24.08
  Bottom 0.152: v79.7,24.08 v80.92,24.08 84.28,24.08 88.7,19.66 v99.97,19.66 | v119.02,24.69 119.02,22.71 118.72,22.4 v118.72,20.88 116.59,18.75 v113.84,18.75
N$47  (via drill 0.35)
  Top 0.152: v115.98,28.5 115.98,26.36 U$3.1 | v115.98,34.9 115.98,36.42 U$5.1 | 83.52,28.04 83.52,28.5 U$25.1 | U$4.1 115.82,16.15 113.39,13.72 108.05,13.72 DNC2.2 107.9,13.72 104.85,16.76 101.96,16.76 91.14,27.58 v90.68,27.58 | v88.24,28.04 83.52,28.04 | 83.52,28.04 U$25.2
  Bottom 0.152: v115.98,28.5 v115.98,34.9 115.37,35.51 108.05,35.51 100.13,27.58 v90.68,27.58 90.22,28.04 v88.24,28.04
N$48
  Top 0.152: U$25.14 89.31,28.5 89.31,28.04 U$25.13 89.31,27.89 89.76,27.89 90.07,27.58 90.07,27.28 100.89,16.46 104.39,16.46 106.83,14.02 106.83,12.95 107.14,12.65 114.3,12.65 116.59,14.94 | 116.59,14.94 116.59,16.15 U$4.2 | 116.59,14.94 120.7,10.82 121.46,10.82 122.38,11.73 122.38,21.49 119.79,24.08 | 119.79,24.08 117.2,24.08 116.43,24.84 116.43,26.21 U$3.2 | 119.79,24.08 121.46,25.76 121.46,36.42 120.7,37.19 116.74,37.19 116.59,37.03 116.59,36.58 U$5.2
N$49  (via drill 0.35)
  Top 0.152: U$25.8 89.31,24.84 89.31,25.3 U$25.9 | U$25.8 89.15,24.69 86.26,24.69 83.82,22.25 83.52,22.25 81.69,20.42 DNC4.2 | v115.82,23.93 115.06,23.16 115.06,20.12 117.65,17.53 117.65,16.31 U$4.4 | v117.04,25.15 117.65,25.76 117.65,26.21 U$3.4 | 111.4,32.61 111.4,29.26 v114.45,26.21 | 111.4,32.61 111.4,33.68 111.71,33.98 116.43,33.98 117.65,35.2 117.65,36.42 U$5.4 | v91.75,24.69 89.31,24.69 U$25.8 | 111.4,32.61 v106.22,32.61
  Bottom 0.152: v117.04,25.15 116.28,24.38 | 116.28,24.38 v115.82,23.93 | 116.28,24.38 v114.45,26.21 | v91.75,24.69 98.3,24.69 v106.22,32.61
N$50  (via drill 0.35)
  Top 0.152: v52.73,43.43 50.29,45.87 38.1,45.87 36.42,44.2 36.42,37.8 36.73,37.49 37.19,37.49 U$2.12 | 57.91,44.35 58.67,44.35 C9.1 | 57.91,44.35 v53.65,44.35 | 57.91,44.35 57.91,41.3 57.61,41 57,41 U1.13
  Bottom 0.152: v53.65,44.35 v52.73,43.43
N$52  (via drill 0.35)
  Top 0.152: v44.2,39.01 42.98,39.01 U4.16 | v50.14,39.62 54.1,39.62 55.17,38.56 55.78,38.56 56.24,39.01 56.84,39.01 U1.16 | v63.86,37.34 64.47,37.34 66.14,39.01 73.3,39.01 U5.16 73.46,39.01 74.07,39.01 74.68,38.41 v74.98,38.41 | v114.3,46.94 114.3,43.74 112.17,41.6 112.17,40.54 v106.83,35.2
  Bottom 0.152: v44.2,39.01 45.11,39.01 45.72,39.62 v50.14,39.62 50.29,39.78 56.08,39.78 57.61,38.25 62.94,38.25 v63.86,37.34 | v114.3,46.94 115.52,48.16 U$1.34 | v106.83,35.2 106.22,34.59 78.79,34.59 v74.98,38.41
N$53  (via drill 0.35)
  Top 0.152: v43.28,35.66 40.23,32.61 36.42,32.61 36.12,32.92 36.12,35.51 36.73,36.12 37.19,36.12 U$2.10 | v44.65,37.03 44.65,38.1 45.11,38.56 45.11,39.01 45.72,39.62 48.46,39.62 U4.6
  Bottom 0.152: v44.65,37.03 v43.28,35.66
N$54
  Top 0.152: U$2.13 37.19,38.25 37.19,38.71 U$2.14 37.34,38.86 37.34,43.28 38.41,44.35 C10.2
N$55  (via drill 0.35)
  Top 0.152: v48.92,7.47 45.41,3.96 39.62,3.96 39.32,4.27 39.32,5.94 38.71,6.55 38.71,8.38 39.01,8.69 39.01,9.3 37.95,10.36 37.19,10.36 U2.16 | v63.25,10.52 64.92,10.52 U3.16 | v43.13,22.55 41.76,22.55 U6.16 | v60.96,21.64 62.48,23.16 63.7,23.16 U7.16
  Bottom 0.152: v48.92,7.47 50.14,7.47 50.6,7.01 59.74,7.01 62.18,9.45 | v63.25,10.52 62.18,9.45 | v43.13,22.55 47.85,22.55 52.73,17.68 53.95,17.68 55.47,16.15 | 62.18,9.45 55.47,16.15 | 55.47,16.15 v60.96,21.64
N$56
  Top 0.152: U$6.11 8.69,34.14 9.14,34.14 17.22,42.22 17.22,45.41 18.59,46.79 72.39,46.79 75.74,43.43 94.49,43.43 99.21,48.16 99.21,48.62 99.97,49.38 105.77,49.38 106.83,48.31 106.83,47.85 107.9,46.79 108.36,46.79 109.42,45.72 109.42,45.26 110.03,44.65 110.95,44.65 111.56,45.26 111.56,47.09 110.49,48.16 U$1.30
N$57
  Top 0.152: U$2.8 37.34,34.75 39.32,34.75 R4.1
N$58
  Top 0.152: U$2.9 37.34,35.66 38.56,35.66 39.32,36.42 R4.2 39.47,36.58 39.47,39.62 DNC5.1 39.47,39.78 40.39,40.69 40.39,41.45 41.15,42.22 42.82,42.22 U4.11
N$59  (via drill 0.35)
  Top 0.152: v13.11,4.88 13.87,4.12 14.17,4.12 U$23.1 | v12.65,7.47 12.65,13.87 14.02,15.24 | 14.02,15.24 14.17,15.39 U$22.1 | 14.02,15.24 12.04,17.22 12.04,18.75 14.17,20.88 14.17,23.01 U$21.1 | C20.1 53.95,22.86 v52.38,23.16
  Bottom 0.152: v13.11,4.88 13.11,5.33 12.65,5.79 v12.65,7.47 19.96,7.47 38.1,25.6 51.21,25.6 v52.38,23.16
N$60
  Top 0.152: U7.11 63.7,19.96 60.05,19.96 58.83,21.18 58.22,21.18 U7.8 58.06,21.34 57.3,21.34 56.84,21.79 56.84,22.86 C20.2
N$62
  Top 0.152: U2.17 37.19,11.12 37.8,11.12 39.62,9.3 39.62,7.62 C7.1 39.78,7.62 40.23,7.16 40.23,5.18 C6.2
N$63  (via drill 0.35)
  Top 0.152: v32.46,36.88 31.85,36.27 31.39,36.27 U$2.5 | v33.38,37.8 33.38,41.91 C11.1 | v81.23,40.23 83.06,40.23 100.28,23.01 100.28,20.73 100.43,20.57 102.72,20.57 103.48,19.81 103.48,19.51 U$7.3 | v41.45,41.6 42.06,41 42.82,41 U4.13
  Bottom 0.152: v32.46,36.88 v33.38,37.8 39.32,43.74 | v81.23,40.23 76.2,45.26 40.84,45.26 39.32,43.74 | 39.32,43.74 v41.45,41.6
N$64
  Top 0.152: U$5.3 117.04,36.42 117.04,35.05 116.28,34.29 105.92,34.29 105.31,34.9 105.31,45.72 U$1.25
N$65
  Top 0.152: U$1.26 104.39,47.24 104.39,45.26 105,44.65 105,32.92 114.76,23.16 114.76,19.96 117.04,17.68 117.04,16.31 U$4.3
N$66  (via drill 0.35)
  Top 0.152: v97.84,48.16 96.77,48.16 95.71,49.23 20.12,49.23 8.69,37.8 8.69,35.36 U$6.9
  Bottom 0.152: v97.84,48.16 98.6,48.16 99.67,47.09 102.11,47.09 102.26,46.94 106.68,46.94 107.9,48.16 U$1.28
N$67  (via drill 0.35)
  Top 0.152: 49.68,8.53 42.52,8.53 41.6,7.62 C7.2 | 49.68,8.53 59.28,8.53 U3.8 | 67.36,17.53 65.53,17.53 60.5,12.5 60.5,12.19 60.2,11.89 59.44,11.89 U3.3 | 67.36,17.53 74.07,17.53 80.31,23.77 80.31,24.38 81.84,25.91 83.36,25.91 U$25.5 | v49.68,8.23 49.68,8.53 | v50.9,7.62 56.54,7.62 59.28,4.88 64.47,4.88 68.12,8.53 v68.12,10.82 | v68.12,12.34 68.12,14.78 67.36,15.54 67.36,17.53
  Bottom 0.152: v49.68,8.23 50.29,8.23 v50.9,7.62 | v68.12,12.34 v68.12,10.82
N$68
  Top 0.152: U$1.29 109.42,46.79 109.42,48.31 108.05,49.68 99.82,49.68 98.91,48.77 98.91,48.31 94.34,43.74 75.89,43.74 72.54,47.09 18.44,47.09 16.92,45.57 16.92,42.67 8.99,34.75 8.69,34.75 U$6.10
N$69  (via drill 0.35)
  Top 0.152: v112.01,33.38 112.01,30.63 113.54,29.11 116.28,29.11 117.04,28.35 117.04,26.36 U$3.3 | v112.01,34.9 112.01,39.93 112.93,40.84 v112.93,41.45
  Bottom 0.152: v112.01,34.9 v112.01,33.38 | v112.93,41.45 109.58,44.81 108.97,44.81 108.05,45.72 U$1.27
N$70  (via drill 0.35)
  Top 0.152: 42.06,38.25 42.82,38.25 U4.17 | 42.06,38.25 40.39,36.58 40.39,33.83 39.78,33.22 v36.73,33.22 | v35.51,32 32.92,32 32.77,31.85 C12.1 | v80.31,37.64 79.1,37.64 U5.3 | v41.6,39.32 41.6,38.71 42.06,38.25
  Bottom 0.152: v35.51,32 v36.73,33.22 | v80.31,37.64 74.83,43.13 55.78,43.13 53.95,44.96 47.24,44.96 v41.6,39.32
N$72
  Top 0.152: U$2.6 31.39,35.51 31.39,34.9 U$2.7 31.24,34.75 31.24,32.16 30.94,31.85 C12.2
N$73
  Top 0.152: U$7.1 104.85,19.51 104.85,20.12 106.22,21.49 R11.2 106.22,21.64 87.02,40.84 79.1,40.84 U5.8
N$74
  Top 0.152: U$7.2 104.24,19.51 104.24,21.34 104.39,21.49 R11.1 104.39,21.64 101.35,21.64 R10.2
N$75
  Top 0.152: 77.57,39.93 77.72,39.78 78.94,39.78 U5.6 | 77.57,39.93 75.29,42.22 73.46,42.22 U5.11 | C17.1 76.2,26.98 76.5,27.28 76.5,37.64 76.2,37.95 76.2,38.56 77.57,39.93
N$76  (via drill 0.35)
  Top 0.152: v83.82,21.64 83.97,21.64 92.96,12.65 98.75,12.65 98.91,12.5 102.87,12.5 103.48,13.11 103.48,13.56 U$7.12 | v72.08,40.84 73.3,40.84 U5.13 | v72.08,34.82 v72.08,30.48
  Bottom 0.152: v83.82,21.64 82.6,22.86 79.7,22.86 v72.08,30.48 | v72.08,34.82 v72.08,40.84
N$77  (via drill 0.35)
  Top 0.152: U$7.14 104.7,13.56 104.24,13.56 U$7.13 104.09,13.72 104.09,15.39 v103.94,15.54 | v117.5,23.47 117.2,23.16 117.2,21.95 U$4.14 117.04,21.79 117.04,21.49 116.59,21.03 v116.59,20.73 | v117.96,27.43 117.96,27.89 117.2,28.65 117.2,32 U$3.14 | v122.07,28.65 122.07,36.27 120.85,37.49 120.24,37.49 117.2,40.54 117.2,42.22 U$5.14 | v82.3,23.47 80.47,23.47 73.61,16.61 68.28,16.61 DNC1.2 | v101.6,15.54 v97.79,15.54
  Bottom 0.152: v117.5,23.47 117.5,24.23 117.96,24.69 117.96,27.28 | v122.07,28.65 120.7,27.28 117.96,27.28 | 117.96,27.28 v117.96,27.43 | v116.59,20.73 116.28,21.03 109.42,21.03 v103.94,15.54 v101.6,15.54 | v82.3,23.47 84.43,23.47 92.35,15.54 v97.79,15.54
N$79  (via drill 0.35)
  Top 0.152: U$7.10 102.11,13.72 102.11,14.17 101.96,14.33 98.45,14.33 97.84,13.72 C16.1 97.69,13.72 87.33,24.08 v86.56,24.08 | v75.89,34.75 75.89,35.2 74.07,37.03 73.46,37.03 U5.19
  Bottom 0.152: v86.56,24.08 v75.89,34.75
N$80  (via drill 0.35)
  Top 0.152: v56.84,27.13 58.06,25.91 U7.1 58.22,25.91 v60.35,25.91 | v56.84,28.35 56.84,29.87 56.24,30.48 C14.1 | v117.81,20.88 118.42,21.49 118.42,21.79 U$4.12 | v118.42,30.02 118.42,32 U$3.12 | v113.23,34.9 113.23,40.69 115.52,42.98 118.11,42.98 118.42,42.67 118.42,42.37 U$5.12 | v61.57,27.13 65.84,27.13 67.06,28.35 75.74,28.35 v75.89,28.5
  Bottom 0.152: v56.84,28.35 v56.84,27.13 | v117.81,20.88 113.84,24.84 113.84,26.52 114.91,27.58 | 114.91,27.58 115.21,27.89 116.28,27.89 v118.42,30.02 | 113.23,31.55 113.23,29.26 114.91,27.58 | 113.23,31.55 v113.23,34.9 | v61.57,27.13 v60.35,25.91 | v75.89,28.5 80.31,28.5 85.34,23.47 98.91,23.47 106.98,31.55 113.23,31.55
N$88  (via drill 0.35)
  Top 0.152: 22.4,44.5 23.16,44.5 C13.1 | 22.4,44.5 20.12,44.5 R8.2 | v118.42,23.01 117.81,22.4 117.81,21.95 U$4.13 | v118.11,28.65 118.11,29.41 117.81,29.72 117.81,32 U$3.13 | 117.81,41 117.81,42.22 U$5.13 | 117.81,41 122.68,36.12 122.68,28.35 v122.07,27.74 | v22.4,46.18 22.4,44.5 | v24.54,48.31 25.15,48.92 95.25,48.92 v96.93,47.24 | 117.81,41 v117.81,40.84
  Bottom 0.152: v118.11,28.65 117.35,27.89 117.35,27.13 117.65,26.82 117.65,24.84 116.89,24.08 116.89,23.16 117.2,22.86 118.26,22.86 v118.42,23.01 118.42,24.99 118.72,25.3 119.63,25.3 v122.07,27.74 | v24.54,48.31 v22.4,46.18 | v96.93,47.24 103.33,40.84 v117.81,40.84
N$95  (via drill 0.35)
  Top 0.152: v13.26,6.1 12.65,6.1 11.73,7.01 11.73,11.73 11.43,12.04 11.43,17.53 8.99,19.96 8.69,19.96 U$22.9 | v48.31,5.03 58.67,5.03 59.13,4.57 96.62,4.57 98.45,6.4 114.3,6.4 115.52,5.18 U$1.14 | v121.01,11.43 121.01,16.61 120.4,17.22 120.4,21.79 U$4.9
  Bottom 0.152: v13.26,6.1 47.24,6.1 v48.31,5.03 | v121.01,11.43 115.67,6.1 115.67,5.18 U$1.14
N$97  (via drill 0.35)
  Top 0.152: v35.51,11.89 34.9,11.28 31.55,11.28 U2.4 | v41.76,16.31 42.22,16.31 45.26,19.36 45.26,20.73 46.33,21.79 47.24,21.79 U6.4 | v58.06,11.12 59.28,11.12 U3.4 | v53.65,17.07 51.16,18.29 51.16,22.86 52.22,23.93 58.06,23.93 U7.4
  Bottom 0.152: v35.51,11.89 39.93,16.31 v41.76,16.31 52.88,16.31 | 52.88,16.31 v58.06,11.12 | 52.88,16.31 v53.65,17.07
N$98  (via drill 0.35)
  Top 0.152: v45.72,38.71 46.02,38.41 48.46,38.41 U4.4 | v60.5,39.17 61.11,39.17 61.87,38.41 62.48,38.41 U1.4 | v76.81,38.25 78.94,38.25 U5.4 | U$1.35 118.11,46.79 116.59,48.31 116.59,48.77 115.98,49.38 112.62,49.38 111.86,48.62 111.86,41.15 v105.92,35.2
  Bottom 0.152: v45.72,38.71 45.41,38.41 43.89,38.41 43.59,38.71 43.59,39.93 44.96,41.3 58.37,41.3 v60.5,39.17 62.18,39.17 64.47,41.45 73.61,41.45 v76.81,38.25 77.42,38.25 80.16,35.51 105.61,35.51 v105.92,35.2
N$101  (via drill 0.35)
  Top 0.152: v45.26,40.69 44.96,40.39 42.98,40.39 U4.14 | v55.02,40.69 55.93,40.69 56.24,40.39 56.84,40.39 U1.14 57,40.39 57.61,40.39 59.74,42.52 59.74,45.41 59.89,45.57 61.42,45.57 66.75,40.23 73.3,40.23 U5.14 | v38.41,8.99 38.25,9.14 37.19,9.14 U2.14 | v42.98,23.77 41.76,23.77 U6.14 | v63.7,9.6 64.01,9.3 64.92,9.3 U3.14 | v65.08,21.79 63.86,21.79 U7.14 | v64.47,29.46 v64.47,34.15
  Bottom 0.152: v45.26,40.69 v55.02,40.69 58.06,40.69 60.2,38.56 63.55,38.56 64.47,37.64 v64.47,34.15 | v38.41,8.99 36.73,7.32 35.2,7.32 33.07,9.45 33.07,13.87 v42.98,23.77 47.09,23.77 49.07,21.79 58.37,21.79 62.18,25.6 62.79,25.6 | v63.7,9.6 63.7,10.06 65.08,11.43 | 65.08,11.43 v65.08,21.79 65.08,23.32 62.79,25.6 | 65.08,11.43 66.29,10.21 90.83,10.21 99.82,1.22 100.89,1.22 101.19,1.52 101.96,1.52 102.26,1.22 103.48,1.22 103.78,1.52 104.55,1.52 104.85,1.22 105.92,1.22 106.22,1.52 107.14,1.52 107.44,1.22 108.51,1.22 108.81,1.52 109.58,1.52 110.49,2.44 U$1.9 | 62.79,25.6 64.47,27.28 v64.47,29.46
V+  (via drill 0.35)
  Top 0.152: v114.61,33.38 114.91,33.07 | 114.91,33.07 115.82,32.16 U$3.16 | v114.15,34.9 114.15,40.54 115.82,42.22 U$5.16 | v115.67,20.42 115.82,20.57 115.82,21.79 U$4.16 | v113.84,20.42 110.64,20.42 108.66,18.44 103.48,18.44 102.87,19.05 U$7.4 102.87,19.81 102.41,20.27 98.91,20.27 90.07,29.11 79.86,29.11 v77.57,26.82 | 114.91,33.07 112.78,30.94 v112.62,30.94 | v8.23,11.43 8.53,11.73 10.82,11.73 11.12,11.43 11.12,5.18 10.06,4.12 8.69,4.12 U$23.16 | v8.23,12.65 8.23,15.09 8.53,15.39 U$22.16 | v10.82,30.79 8.69,30.79 U$6.16 | v12.34,30.79 12.65,30.79 13.87,32 14.17,32 U$6.3 14.33,32 14.78,32 15.7,31.09 24.99,31.09 27.28,33.38 | 27.28,33.38 30.63,36.73 31.24,36.73 U$2.4 | U4.20 42.98,36.58 42.98,37.03 U4.19 | U4.20 42.98,36.42 47.24,36.42 47.7,35.97 56.39,35.97 56.84,36.42 U1.20 56.84,36.58 56.84,37.03 U1.19 57,37.03 v59.59,37.03 | v39.01,14.48 37.64,13.11 37.19,13.11 U2.20 | v40.23,15.7 40.23,18.44 41.6,19.81 U6.20 | v61.57,11.12 60.35,9.91 59.44,9.91 U3.6 59.28,9.91 58.67,9.91 58.37,10.21 v58.06,10.21 | v62.48,12.04 64.01,12.04 64.31,12.34 64.92,12.34 U3.19 65.08,12.5 65.08,12.95 U3.20 | U$25.4 79.25,26.67 v78.03,25.45 | v74.22,29.26 74.22,35.66 73.46,36.42 U5.20 73.3,36.42 62.64,36.42 U1.1 62.48,36.42 61.87,35.81 v60.81,35.81 | v75.89,27.58 66.75,27.58 65.08,25.91 63.86,25.91 U7.20 63.86,25.76 63.86,25.15 U7.19 63.7,24.99 v62.48,24.99 | 27.28,33.38 30.02,30.63 37.34,30.63 v38.41,31.7 | v41,34.29 41,34.59 42.82,36.42 U4.20
  Bottom 0.152: v114.61,33.38 114.61,34.44 v114.15,34.9 | U$1.1 98.91,3.96 98.91,5.49 v113.84,20.42 v115.67,20.42 115.98,20.12 116.89,20.12 117.2,20.42 117.2,21.03 116.89,21.34 114.15,21.34 111.4,24.08 111.4,24.69 112.62,25.91 v112.62,30.94 | v8.23,11.43 v8.23,12.65 8.23,20.12 8.84,20.73 8.84,28.8 v10.82,30.79 v12.34,30.79 | v39.01,14.48 v40.23,15.7 52.58,15.7 v58.06,10.21 | v61.57,11.12 v62.48,12.04 v62.48,24.99 | v74.22,29.26 v75.89,27.58 77.11,26.36 | 77.11,26.36 v78.03,25.45 | v60.81,35.81 v59.59,37.03 | v41,34.29 v38.41,31.7 | 77.11,26.36 v77.57,26.82